# Altium project 3562.PrjPcb (part 4 of 5)

## Sheet P10_ETH0 RGMII.SchDoc
size 420 x 297 mm
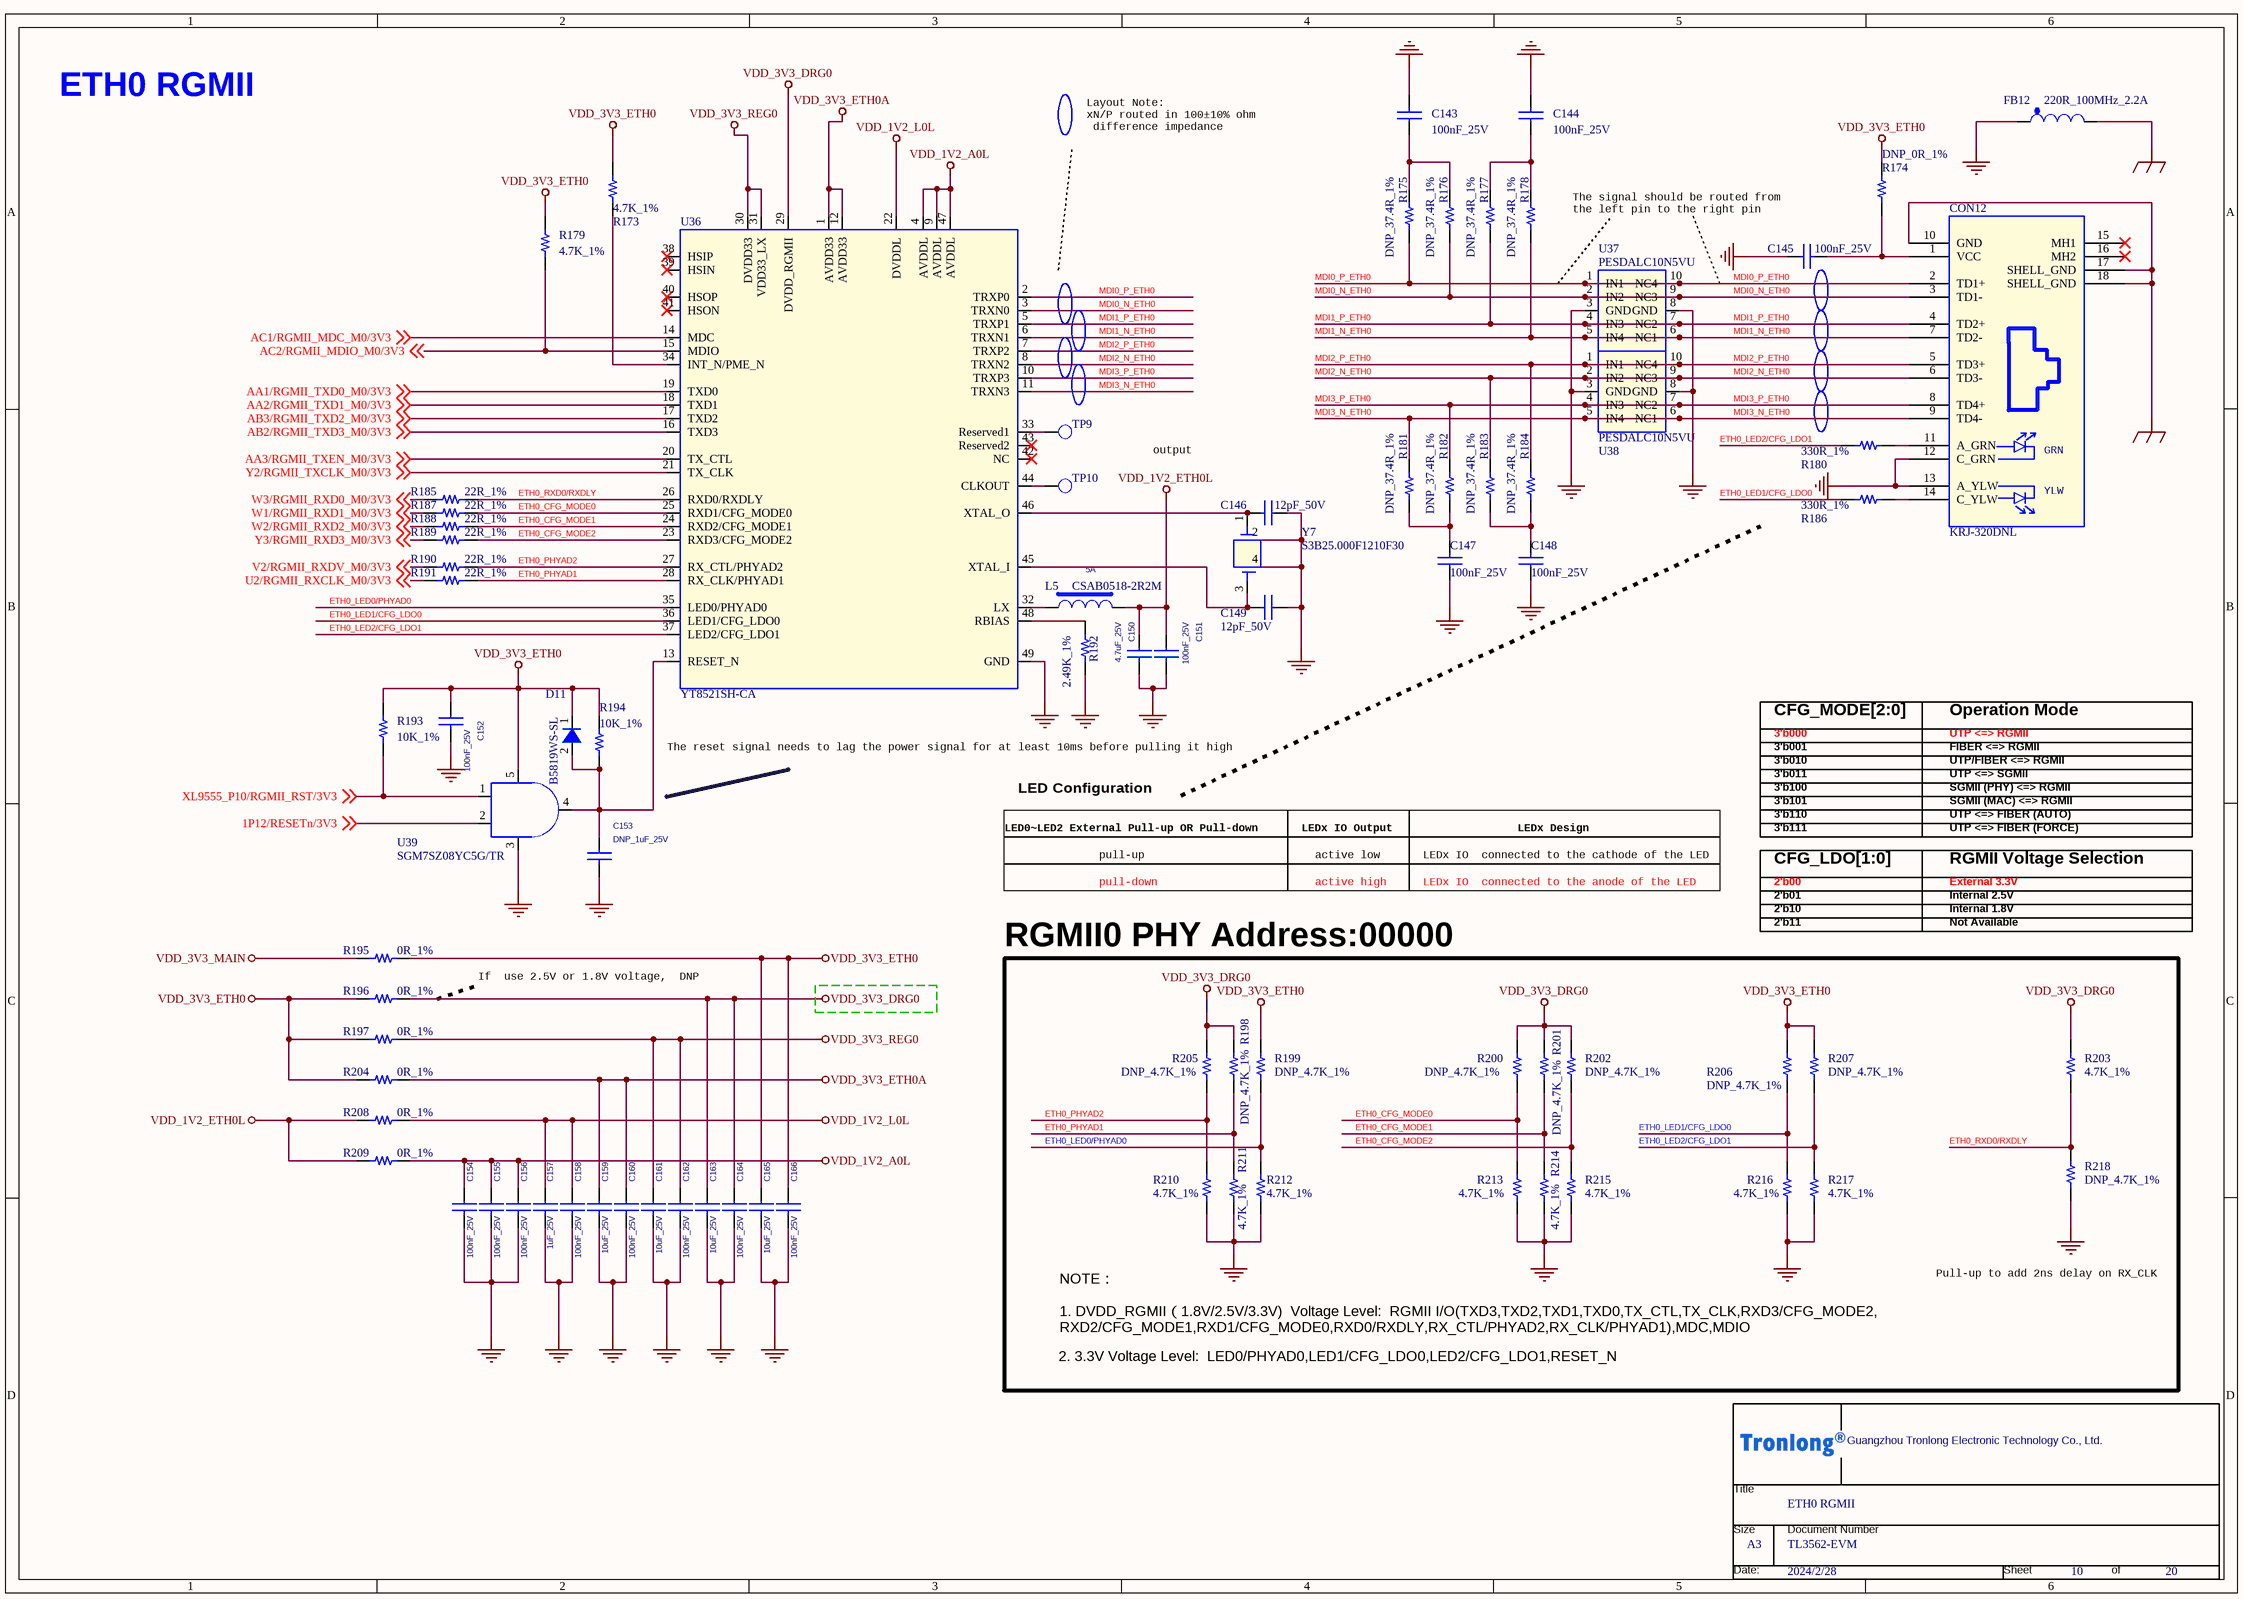
[diagram p23: P10_ETH0 RGMII.SchDoc]

### Parts
(Parts that share a designator on the sheet are numbered #1, #2 ... from top to bottom, then left to right.)
*#10  Page Count: 20  Page Number: 10  Page Size: A3  OrgName: Guangzhou Tronlong Electronic Technology Co., Ltd.  Title: ETH0 RGMII  Doc: TL3562-EVM  Page Modify Date: 2024/2/28  (hidden comment: Tronlong_TITTLE_20211115)  (graphical)
C143  100nF_25V  [C0402]
C144  100nF_25V  [C0402]
C145  100nF_25V  [C0402]
C146  12pF_50V  [C0402]
C147  100nF_25V  [C0402]
C148  100nF_25V  [C0402]
C149  12pF_50V  [C0402]
C150  4.7uF_25V  [C0603]
C151  100nF_25V  [C0402]
C152  100nF_25V  [C0402]
C153  DNP_1uF_25V  [C0603]
C154  100nF_25V  [C0402]
C155  100nF_25V  [C0402]
C156  100nF_25V  [C0402]
C157  1uF_25V  [C0603]
C158  100nF_25V  [C0402]
C159  10uF_25V  [C0603]
C160  100nF_25V  [C0402]
C161  10uF_25V  [C0603]
C162  100nF_25V  [C0402]
C163  10uF_25V  [C0603]
C164  100nF_25V  [C0402]
C165  10uF_25V  [C0603]
C166  100nF_25V  [C0402]
CON12  KRJ-320DNL  [KRJ-320DNL_14P]
D11  B5819WS-SL  [SOD-323]
FB12  220R_100MHz_2.2A  [L0603]
L5  CSAB0518-2R2M  Current: 5A  [SMD-L2520M-2P]
R173  4.7K_1%  [R0402]
R174  DNP_0R_1%  [R0402]
R175  DNP_37.4R_1%  [R0603]
R176  DNP_37.4R_1%  [R0603]
R177  DNP_37.4R_1%  [R0603]
R178  DNP_37.4R_1%  [R0603]
R179  4.7K_1%  [R0402]
R180  330R_1%  [R0402]
R181  DNP_37.4R_1%  [R0603]
R182  DNP_37.4R_1%  [R0603]
R183  DNP_37.4R_1%  [R0603]
R184  DNP_37.4R_1%  [R0603]
R185  22R_1%  [R0402]
R186  330R_1%  [R0402]
R187  22R_1%  [R0402]
R188  22R_1%  [R0402]
R189  22R_1%  [R0402]
R190  22R_1%  [R0402]
R191  22R_1%  [R0402]
R192  2.49K_1%  [R0603]
R193  10K_1%  [R0402]
R194  10K_1%  [R0402]
R195  0R_1%  [R0603]
R196  0R_1%  [R0603]
R197  0R_1%  [R0603]
R198  DNP_4.7K_1%  [R0402]
R199  DNP_4.7K_1%  [R0402]
R200  DNP_4.7K_1%  [R0402]
R201  DNP_4.7K_1%  [R0402]
R202  DNP_4.7K_1%  [R0402]
R203  4.7K_1%  [R0402]
R204  0R_1%  [R0603]
R205  DNP_4.7K_1%  [R0402]
R206  DNP_4.7K_1%  [R0402]
R207  DNP_4.7K_1%  [R0402]
R208  0R_1%  [R0603]
R209  0R_1%  [R0603]
R210  4.7K_1%  [R0402]
R211  4.7K_1%  [R0402]
R212  4.7K_1%  [R0402]
R213  4.7K_1%  [R0402]
R214  4.7K_1%  [R0402]
R215  4.7K_1%  [R0402]
R216  4.7K_1%  [R0402]
R217  4.7K_1%  [R0402]
R218  DNP_4.7K_1%  [R0402]
TP9  SMT TP  [TP30]  (value not drawn)
TP10  SMT TP  [TP30]  (value not drawn)
U36  YT8521SH-CA  [QFN48]
U37  PESDALC10N5VU  [DFN-10-2510]
U38  PESDALC10N5VU  [DFN-10-2510]
U39  SGM7SZ08YC5G/TR  [SC70-5-43M]
Y7  S3B25.000F1210F30  [SMD_3225]

### Blocks framed on the sheet
RGMII0 PHY Address:00000: R198-R203 R205-R207 R210-R218

### Nets
EGND: CON12.10(GND) CON12.17(SHELL_GND) CON12.18(SHELL_GND) FB12.2
GND: C143.2 C144.2 C145.1 C146.1 C147.1 C148.1 C149.1 C150.2 C151.2 C152.2 C153.2 C154.2 C155.2 C156.2 C157.2 C158.2 C159.2 C160.2 C161.2 C162.2 C163.2 C164.2 C165.2 C166.2 CON12.12(C_GRN) CON12.13(A_YLW) FB12.1 R192.1 R210.1 R211.1 R212.1 R213.1 R214.1 R215.1 R216.1 R217.1 R218.1 U36.49(GND) U37.3(GND) U37.8(GND) U38.3(GND) U38.8(GND) U39.3(GND) Y7.2 Y7.4
VDD_1V2_A0L: C154.1 C155.1 C156.1 R209.2 U36.4(AVDDL) U36.9(AVDDL) U36.47(AVDDL)
VDD_1V2_ETH0L: C150.1 C151.1 L5.2 R208.1 R209.1
VDD_1V2_L0L: C157.1 C158.1 R208.2 U36.22(DVDDL)
VDD_3V3_DRG0: C163.1 C164.1 R196.2 R198.2 R200.2 R201.2 R202.2 R203.2 R205.2 U36.29(DVDD_RGMII)
VDD_3V3_ETH0: C152.1 C165.1 C166.1 D11.1(Cathode) R173.2 R174.1 R179.1 R193.1 R194.2 R195.2 R196.1 R197.1 R199.2 R204.1 R206.2 R207.2 U39.5(VCC)
VDD_3V3_ETH0A: C159.1 C160.1 R204.2 U36.1(AVDD33) U36.12(AVDD33)
VDD_3V3_MAIN: R195.1
VDD_3V3_REG0: C161.1 C162.1 R197.2 U36.30(DVDD33) U36.31(VDD33_LX)
1P12/RESETn/3V3: U39.2(B) ; off-sheet 1P12/RESETn/3V3
AA1/RGMII_TXD0_M0/3V3: U36.19(TXD0) ; off-sheet AA1/RGMII_TXD0_M0/3V3
AA2/RGMII_TXD1_M0/3V3: U36.18(TXD1) ; off-sheet AA2/RGMII_TXD1_M0/3V3
AA3/RGMII_TXEN_M0/3V3: U36.20(TX_CTL) ; off-sheet AA3/RGMII_TXEN_M0/3V3
AB2/RGMII_TXD3_M0/3V3: U36.16(TXD3) ; off-sheet AB2/RGMII_TXD3_M0/3V3
AB3/RGMII_TXD2_M0/3V3: U36.17(TXD2) ; off-sheet AB3/RGMII_TXD2_M0/3V3
AC1/RGMII_MDC_M0/3V3: U36.14(MDC) ; off-sheet AC1/RGMII_MDC_M0/3V3
AC2/RGMII_MDIO_M0/3V3: R179.2 U36.15(MDIO) ; off-sheet AC2/RGMII_MDIO_M0/3V3
ETH0_CFG_MODE0: R187.2 R200.1 R213.2 U36.25(RXD1/CFG_MODE0)
ETH0_CFG_MODE1: R188.2 R201.1 R214.2 U36.24(RXD2/CFG_MODE1)
ETH0_CFG_MODE2: R189.2 R202.1 R215.2 U36.23(RXD3/CFG_MODE2)
ETH0_LED0/PHYAD0: R199.1 R212.2 U36.35(LED0/PHYAD0)
ETH0_LED1/CFG_LDO0: R186.1 R206.1 R216.2 U36.36(LED1/CFG_LDO0)
ETH0_LED2/CFG_LDO1: R180.1 R207.1 R217.2 U36.37(LED2/CFG_LDO1)
ETH0_PHYAD1: R191.2 R198.1 R211.2 U36.28(RX_CLK/PHYAD1)
ETH0_PHYAD2: R190.2 R205.1 R210.2 U36.27(RX_CTL/PHYAD2)
ETH0_RXD0/RXDLY: R185.2 R203.1 R218.2 U36.26(RXD0/RXDLY)
MDI0_N_ETH0: CON12.3(TD1-) R176.2 U36.3(TRXN0) U37.2(IN2) U37.9(NC3)
MDI0_P_ETH0: CON12.2(TD1+) R175.2 U36.2(TRXP0) U37.1(IN1) U37.10(NC4)
MDI1_N_ETH0: CON12.7(TD2-) R178.2 U36.6(TRXN1) U37.5(IN4) U37.6(NC1)
MDI1_P_ETH0: CON12.4(TD2+) R177.2 U36.5(TRXP1) U37.4(IN3) U37.7(NC2)
MDI2_N_ETH0: CON12.6(TD3-) R183.1 U36.8(TRXN2) U38.2(IN2) U38.9(NC3)
MDI2_P_ETH0: CON12.5(TD3+) R184.1 U36.7(TRXP2) U38.1(IN1) U38.10(NC4)
MDI3_N_ETH0: CON12.9(TD4-) R181.1 U36.11(TRXN3) U38.5(IN4) U38.6(NC1)
MDI3_P_ETH0: CON12.8(TD4+) R182.1 U36.10(TRXP3) U38.4(IN3) U38.7(NC2)
U2/RGMII_RXCLK_M0/3V3: R191.1 ; off-sheet U2/RGMII_RXCLK_M0/3V3
V2/RGMII_RXDV_M0/3V3: R190.1 ; off-sheet V2/RGMII_RXDV_M0/3V3
W1/RGMII_RXD1_M0/3V3: R187.1 ; off-sheet W1/RGMII_RXD1_M0/3V3
W2/RGMII_RXD2_M0/3V3: R188.1 ; off-sheet W2/RGMII_RXD2_M0/3V3
W3/RGMII_RXD0_M0/3V3: R185.1 ; off-sheet W3/RGMII_RXD0_M0/3V3
XL9555_P10/RGMII_RST/3V3: R193.2 U39.1(A) ; off-sheet XL9555_P10/RGMII_RST/3V3
Y2/RGMII_TXCLK_M0/3V3: U36.21(TX_CLK) ; off-sheet Y2/RGMII_TXCLK_M0/3V3
Y3/RGMII_RXD3_M0/3V3: R189.1 ; off-sheet Y3/RGMII_RXD3_M0/3V3
NetC143_1: C143.1 R175.1 R176.1
NetC144_1: C144.1 R177.1 R178.1
NetC145_2: C145.2 CON12.1(VCC) R174.2
NetC146_2: C146.2 U36.46(XTAL_O) Y7.1
NetC147_2: C147.2 R181.2 R182.2
NetC148_2: C148.2 R183.2 R184.2
NetC149_2: C149.2 U36.45(XTAL_I) Y7.3
NetC153_1: C153.1 D11.2(Anode) R194.1 U36.13(RESET_N) U39.4(Y)
NetCON12_11: CON12.11(A_GRN) R180.2
NetCON12_14: CON12.14(C_YLW) R186.2
NetL5_1: L5.1 U36.32(LX)
NetR173_1: R173.1 U36.34(INT_N/PME_N)
NetR192_2: R192.2 U36.48(RBIAS)
NetTP9_1: TP9.1(TP) U36.33(Reserved1)
NetTP10_1: TP10.1(TP) U36.44(CLKOUT)

Not connected (* = marked no-connect by the designer): CON12 15(MH1)* 16(MH2)*; U36 38(HSIP)* 39(HSIN)* 40(HSOP)* 41(HSON)* 42(NC)* 43(Reserved2)*

### Notes on the sheet
- ETH0 RGMII
- Layout Note:
  xN/P routed in 100±10% ohm
  difference impedance
- The signal should be routed from
  the left pin to the right pin
- output
- CFG_MODE[2:0]
- 3'b000
- UTP <=> RGMII
- Operation Mode
- The reset signal needs to lag the power signal for at least 10ms before pulling it high
- LED Configuration
- 3'b001
- 3'b010
- 3'b011
- 3'b100
- 3'b101
- FIBER <=> RGMII
- UTP/FIBER <=> RGMII
- UTP <=> SGMII
- SGMII (PHY) <=> RGMII
- SGMII (MAC) <=> RGMII
- LED0~LED2 External Pull-up OR Pull-down
- pull-up
- LEDx IO Output
- active low
- LEDx IO  connected to the cathode of the LED
- LEDx Design
- 3'b110
- 3'b111
- CFG_LDO[1:0]
- UTP <=> FIBER (AUTO)
- UTP <=> FIBER (FORCE)
- RGMII Voltage Selection
- pull-down
- active high
- LEDx IO  connected to the anode of the LED
- 2'b00
- 2'b01
- 2'b10
- 2'b11
- External 3.3V
- Internal 2.5V
- Internal 1.8V
- Not Available
- If  use 2.5V or 1.8V voltage,  DNP
- Pull-up to add 2ns delay on RX_CLK
- NOTE：
  1. DVDD_RGMII（1.8V/2.5V/3.3V)  Voltage Level:  RGMII I/O(TXD3,TXD2,TXD1,TXD0,TX_CTL,TX_CLK,RXD3/CFG_MODE2,
  RXD2/CFG_MODE1,RXD1/CFG_MODE0,RXD0/RXDLY,RX_CTL/PHYAD2,RX_CLK/PHYAD1),MDC,MDIO
- 2. 3.3V Voltage Level:  LED0/PHYAD0,LED1/CFG_LDO0,LED2/CFG_LDO1,RESET_N
- (in symbol KRJ-320DNL_1) GRN; YLW
- (in symbol Tronlong_TITTLE_20211115) Title; Size; Document Number; Date:; Sheet; of

### Library data of the parts
*#10 = Tronlong_TITTLE_20211115: RevCode: A?; Page Create Date: March  8, 1995
C143-C145 C147 C148 C151 C152 C154-C156 C158 C160 C162 C164 C166 = CAP NP_Dup3: 贴片陶瓷电容,100nF,10%,25V,X5R; Manufacturer Character: 中国大陆; Operation Temperature（℃）: -55~85℃; As-Welded: /; PCB Footprint: C0402
C146 C149 = CAP NP_Dup3: 贴片陶瓷电容,12pF,5%,50V,COG; Manufacturer Character: 中国大陆; As-Welded: /; Operation Temperature（℃）: -55~125℃; PCB Footprint: C0402
C150 = CAP NP_Dup3: 贴片陶瓷电容,4.7uF,10%,25V,X5R; Manufacturer Character: 中国大陆; Operation Temperature（℃）: -55~85℃; As-Welded: /; PCB Footprint: C0603
C153 = CAP NP_Dup3: 贴片陶瓷电容,1uF,10%,25V,X5R; Manufacturer Character: 中国大陆; As-Welded: DNP; Operation Temperature（℃）: -55~85℃; PCB Footprint: C0603
C157 = CAP NP_Dup3: 贴片陶瓷电容,1uF,10%,25V,X5R; Manufacturer Character: 中国大陆; Operation Temperature（℃）: -55~85℃; As-Welded: /; PCB Footprint: C0603
C159 C161 C165 = CAP NP_Dup3: 贴片陶瓷电容,10uF,10%,10V,X5R; Manufacturer Character: 中国大陆; As-Welded: /; Operation Temperature（℃）: -55~85℃; PCB Footprint: C0603
C163 = CAP NP_Dup3: 贴片陶瓷电容,10uF,10%,10V,X5R; Manufacturer Character: 中国大陆; Operation Temperature（℃）: -55~85℃; As-Welded: /; PCB Footprint: C0603
CON12 = KRJ-320DNL_1: RJ45连接器,14PIN,90度,母座,插件; Manufacturer: 东莞市科优达电子科技有限公司（DGKYD）; Manufacturer Character: 中国大陆; As-Welded: /; Operation Temperature（℃）: -40~85℃; Manufacturer PartNumber: KRJ-320DNL; Temperature: -40~85℃; PCB Footprint: KRJ-320DNL_14P
D11 = Diode200mA250V: 肖特基二极管,VR=40V,IF=1A,VF=0.6V@1A; Mfr: On Semiconductor; MfrNum: MMSD103T1G; TIIntPartnumber: 1E0013; Manufacturer Character: 中国大陆; Manufacturer: 江苏长晶科技有限公司（JSCJ）; Descriptive_Text: Diode 200mA 250V 1.25V Forward Drop; Vendor: Digikey; Cost100: 0.23; Cost10K: 0.07; PCB Footprint: smd123; As-Welded: /; Operation Temperature（℃）: -55~125℃; PartName: Diode200mA250V; DescriptiveText: Diode 200mA 250V 1.25V Forward Drop; Temperature: -55~150; Manufacturer PartNumber: B5819WS-SL
FB12 = FERRITE BEAD_Dup2: 磁珠,50mΩ,2.2A,220R@100MHz; Manufacturer Character: 中国大陆; Manufacturer: 深圳顺络电子股份有限公司（Sunlord）; Manufacturer PartNumber: UPZ1608U221-2R2TF; As-Welded: /; Operation Temperature（℃）: -55~125℃; Temperature: -55~125; PCB Footprint: L0603
L5 = INDUCTOR: 贴片功率电感,2.2uH,0.035Ω,Isat=6.5A,Irms=5A; Manufacturer Character: 中国大陆; Manufacturer: 深圳市科达嘉电子有限公司（CODACA）; Parameter: L2520，奇力新一体成型电感，最大额定电流3A，内阻65毫欧，20%; PCB Footprint: SMD_CSAB0518; As-Welded: /; Operation Temperature（℃）: -40~125℃; Manufacturer PartNumber: CSAB0518-2R2M; Temperature: -40~125℃
R173 R179 R212 R214-R217 = Resistor_Dup3: 贴片电阻,4.7K,±1%,1/16W; Manufacturer Character: 中国大陆; CLASS: DISCRETE; As-Welded: /; Operation Temperature（℃）: -55~155℃; PCB Footprint: R0402
R174 = Resistor_Dup3: 贴片电阻,0R,±1%,1/16W; Manufacturer Character: 中国大陆; CLASS: DISCRETE; Operation Temperature（℃）: -55~155℃; As-Welded: DNP; PCB Footprint: R0402
R175-R178 R181-R184 = Resistor_Dup3: 37.4R,±1%,R0603,≥1/10W; Manufacturer Character: 中国大陆; CLASS: DISCRETE; Operation Temperature（℃）: -40~85℃; As-Welded: DNP; PCB Footprint: R0603
R180 R186 = Resistor_Dup3: 贴片电阻,330R,±1%,1/16W; Manufacturer Character: 中国大陆; CLASS: DISCRETE; Operation Temperature（℃）: -55~155℃; As-Welded: /; PCB Footprint: R0402
R185 R187-R191 = Resistor_Dup3: 贴片电阻,22R,±1%,1/16W; Manufacturer Character: 中国大陆; CLASS: DISCRETE; As-Welded: /; Operation Temperature（℃）: -55~155℃; room: RS232; PCB Footprint: R0402
R192 = Resistor_Dup3: 贴片电阻,2.49K,±1%,1/10W; Manufacturer Character: 中国大陆; CLASS: DISCRETE; Operation Temperature（℃）: -55~155℃; As-Welded: /; PCB Footprint: R0603
R193 R194 = Resistor_Dup3: 贴片电阻,10K,±1%,1/16W; Manufacturer Character: 中国大陆; CLASS: DISCRETE; As-Welded: /; Operation Temperature（℃）: -55~155℃; PCB Footprint: R0402
  R193: Temperature: –55~155℃
R195-R197 R204 R208 R209 = Resistor_Dup3: 0R,±1%,R0603,≥1/10W; Manufacturer Character: 中国大陆; CLASS: DISCRETE; Operation Temperature（℃）: -55~155℃; room: RS232; As-Welded: /; PCB Footprint: R0603
R198 R199 R201 R202 R205-R207 R218 = Resistor_Dup3: 贴片电阻,4.7K,±1%,1/16W; Manufacturer Character: 中国大陆; CLASS: DISCRETE; Operation Temperature（℃）: -55~155℃; As-Welded: DNP; PCB Footprint: R0402
R200 = Resistor_Dup3: 贴片电阻,4.7K,±1%,1/16W; Manufacturer Character: 中国大陆; CLASS: DISCRETE; As-Welded: DNP; Operation Temperature（℃）: -55~155℃; PCB Footprint: R0402
R203 R210 R211 R213 = Resistor_Dup3: 贴片电阻,4.7K,±1%,1/16W; Manufacturer Character: 中国大陆; CLASS: DISCRETE; Operation Temperature（℃）: -55~155℃; As-Welded: /; PCB Footprint: R0402
TP9 TP10 = T POINT R: Manufacturer Character: 中国大陆; CLASS: IC; AGILE_PN: 510-75618; CAD_APPROVED: Yes; As-Welded: /; PCB Footprint: TP30; HEIGHT: 0.1MM
U36 = YT8521S: 以太网收发器，RGMII/SGMII; Manufacturer: 苏州裕太微电子有限公司（Motorcomm）; Manufacturer Character: 中国大陆; As-Welded: /; Operation Temperature（℃）: -40~85℃; Manufacturer PartNumber: YT8521SH-CA; Temperature: -40~85; PCB Footprint: QFN48
U37 = SU099PGTR: 4通道超低电容瞬态抑制器; Manufacturer Character: 中国大陆; Manufacturer: 上海芯导电子科技有限公司（Prisemi）; Operation Temperature（℃）: -40~85℃; As-Welded: /; Manufacturer PartNumber: PESDALC10N5VU; Temperature: -55~150; PCB Footprint: DFN-10-2510
U38 = SU099PGTR: 4通道超低电容瞬态抑制器; Manufacturer: 上海芯导电子科技有限公司（Prisemi）; Manufacturer Character: 中国大陆; Operation Temperature（℃）: -40~85℃; As-Welded: /; Manufacturer PartNumber: PESDALC10N5VU; Temperature: -55~150; PCB Footprint: DFN-10-2510
U39 = 74LVC1G08: 1个两输入与门; Manufacturer: 圣邦微电子股份有限公司（SGMICRO）; Manufacturer Character: 中国大陆; As-Welded: /; Operation Temperature（℃）: -40~85℃; Manufacturer PartNumber: SGM7SZ08YC5G/TR; Temperature: -40~85℃; PCB Footprint: SC70-5-43M
Y7 = CRYSTAL-4 PIN: 四脚无源晶振,25MHz,±10ppm,12pF,30Ω,±30ppm; Manufacturer Character: 中国大陆; Manufacturer: 深圳市星通时频电子有限公司公司（JSCJ）; As-Welded: /; Operation Temperature（℃）: -40~85℃; Manufacturer PartNumber: S3B25.000F1210F30; Temperature: -40~85; PCB Footprint: SMD_3225

## Sheet P11_ETH1 RMII.SchDoc
size 420 x 297 mm
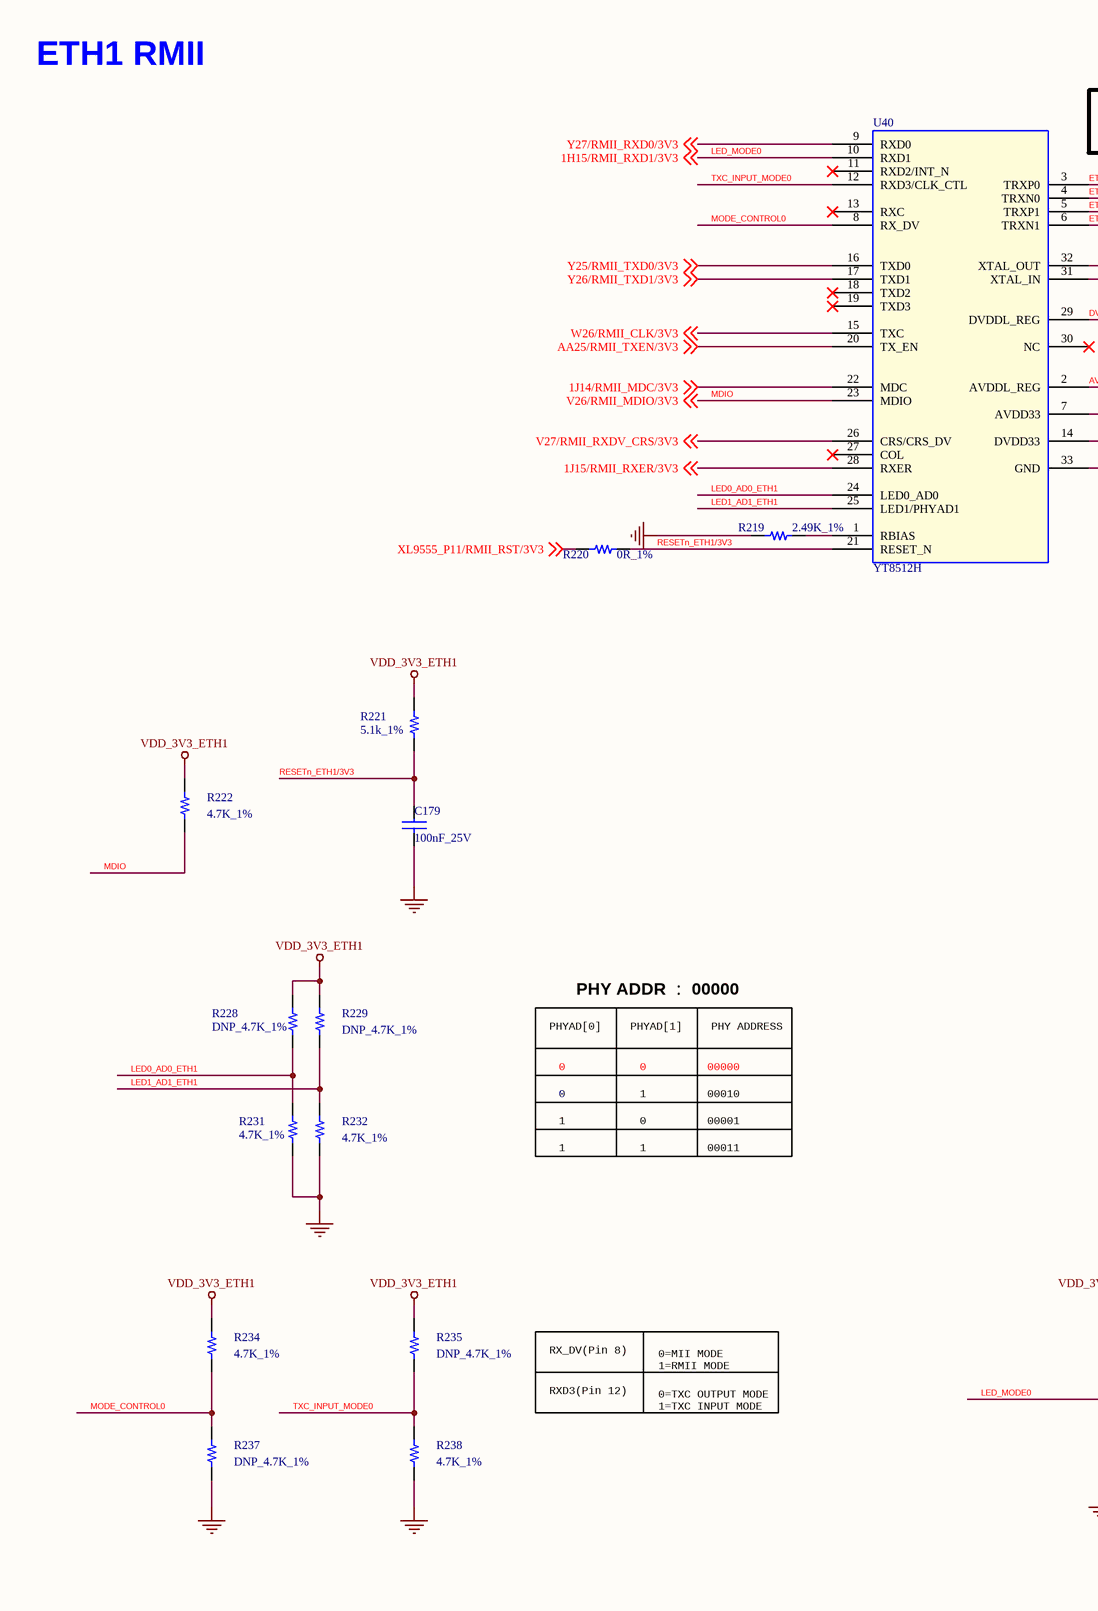
[diagram p24: P11_ETH1 RMII.SchDoc, left]
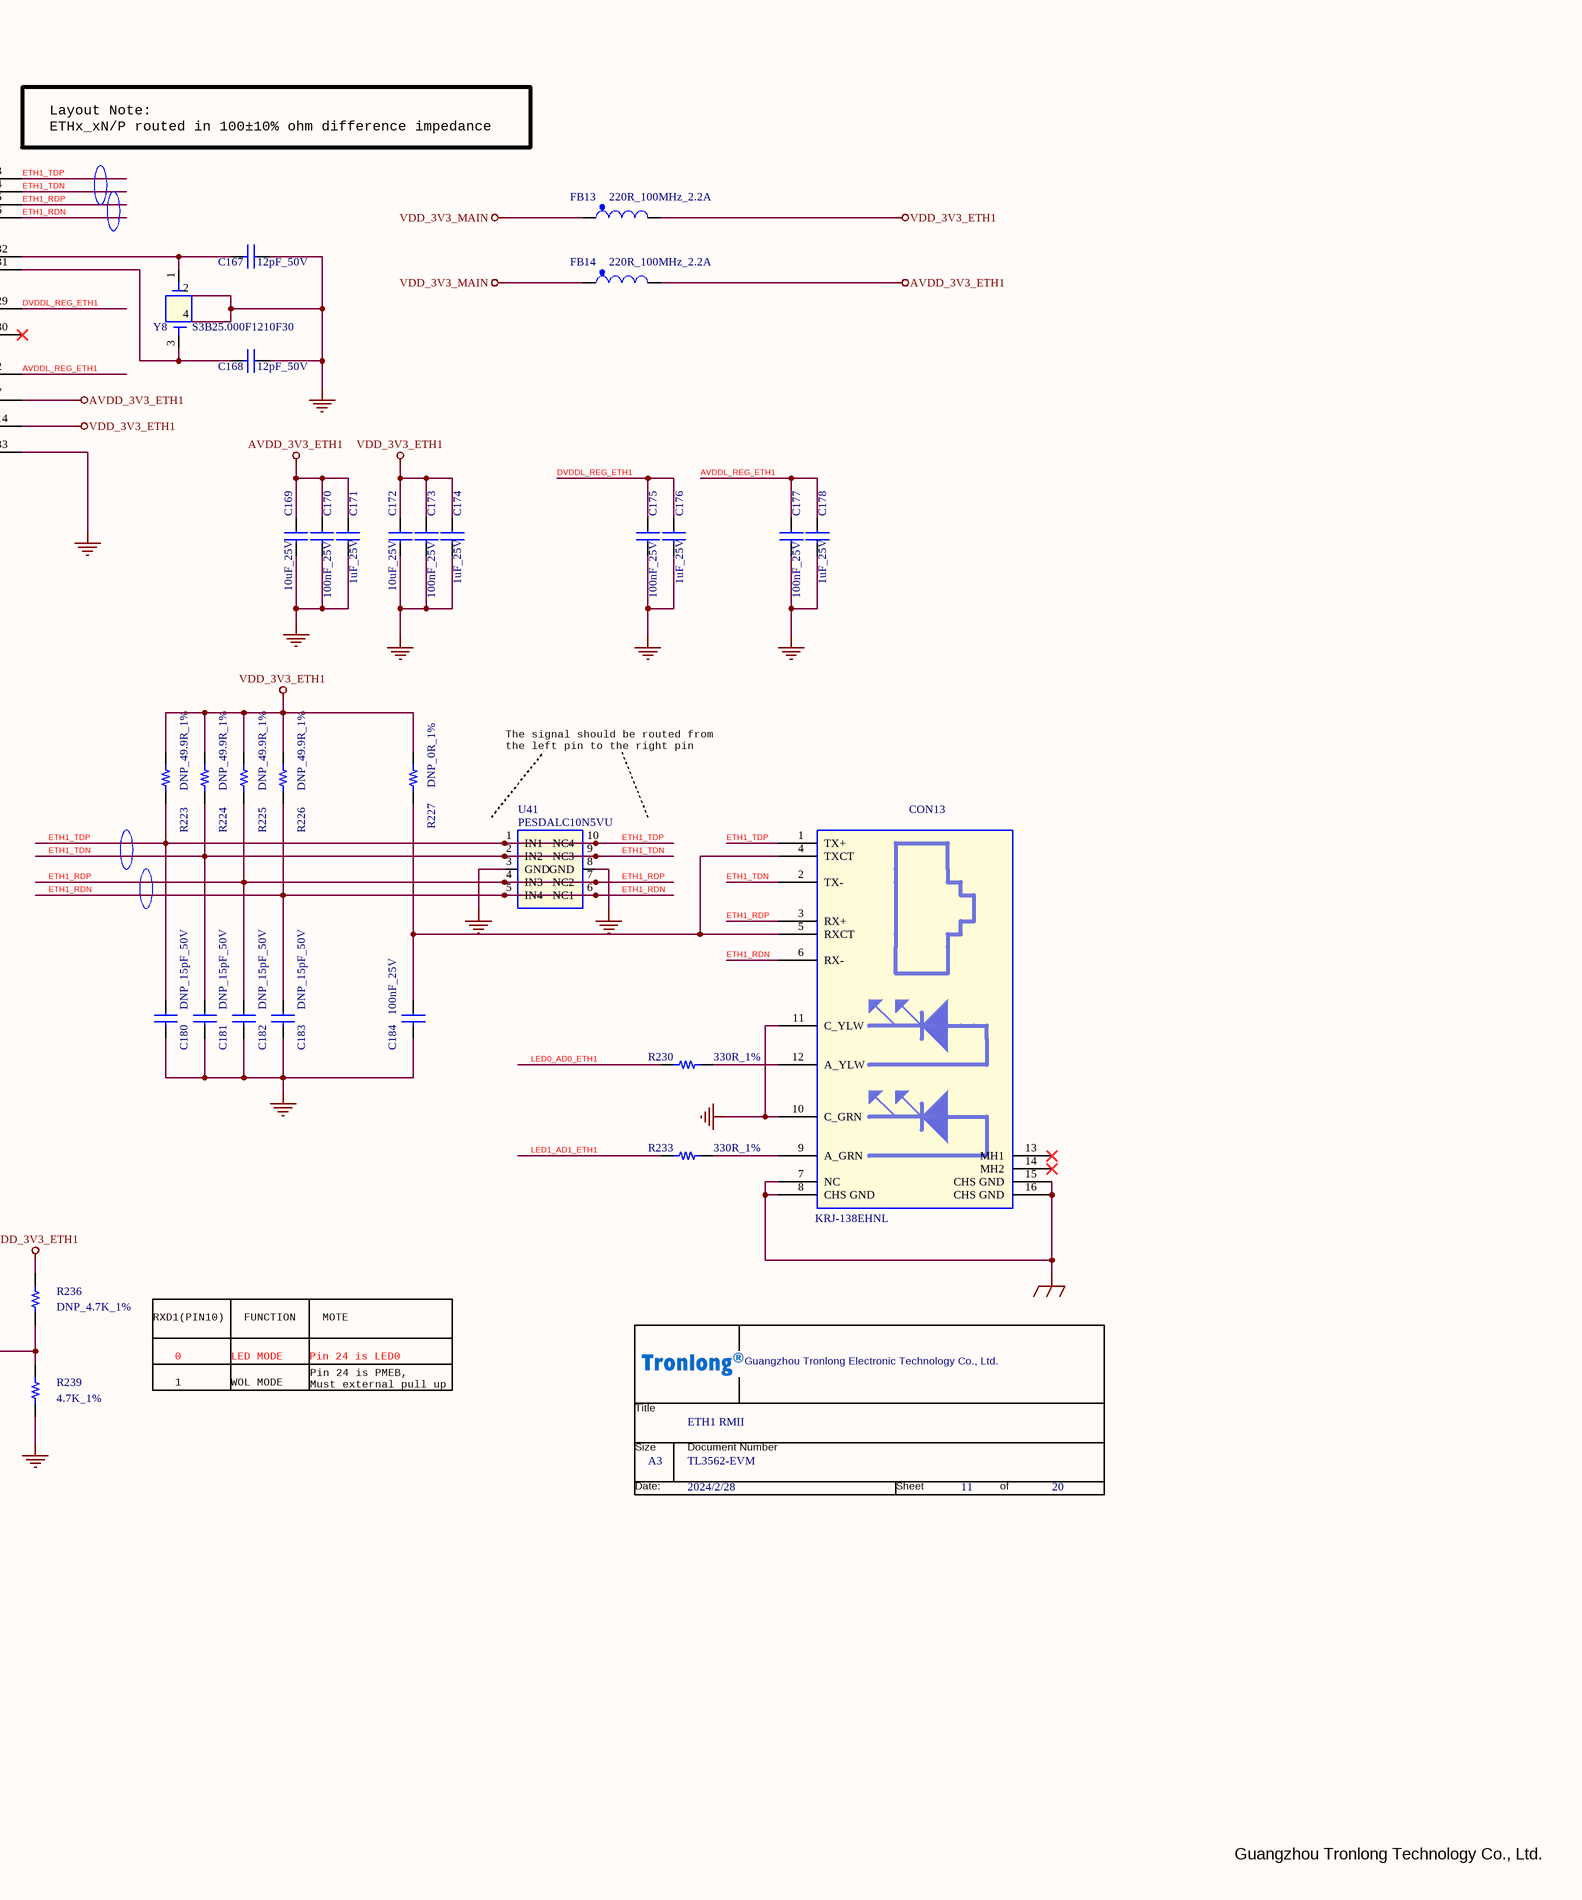
[diagram p25: P11_ETH1 RMII.SchDoc, right]

### Parts
(Parts that share a designator on the sheet are numbered #1, #2 ... from top to bottom, then left to right.)
*#11  Page Count: 20  Page Number: 11  Page Size: A3  OrgName: Guangzhou Tronlong Electronic Technology Co., Ltd.  Title: ETH1 RMII  Doc: TL3562-EVM  Page Modify Date: 2024/2/28  (hidden comment: Tronlong_TITTLE_20211115)  (graphical)
C167  12pF_50V  [C0402]
C168  12pF_50V  [C0402]
C169  10uF_25V  [C0603]
C170  100nF_25V  [C0402]
C171  1uF_25V  [C0603]
C172  10uF_25V  [C0603]
C173  100nF_25V  [C0402]
C174  1uF_25V  [C0603]
C175  100nF_25V  [C0402]
C176  1uF_25V  [C0603]
C177  100nF_25V  [C0402]
C178  1uF_25V  [C0603]
C179  100nF_25V  [C0402]
C180  DNP_15pF_50V  [C0603]
C181  DNP_15pF_50V  [C0603]
C182  DNP_15pF_50V  [C0603]
C183  DNP_15pF_50V  [C0603]
C184  100nF_25V  [C0402]
CON13  KRJ-138EHNL  [CON_YDS_13F-64GYD2PLXNL]
FB13  220R_100MHz_2.2A  [L0603]
FB14  220R_100MHz_2.2A  [L0603]
R219  2.49K_1%  [R0603]
R220  0R_1%  [R0402]
R221  5.1k_1%  [R0402]
R222  4.7K_1%  [R0402]
R223  DNP_49.9R_1%  [R0603]
R224  DNP_49.9R_1%  [R0603]
R225  DNP_49.9R_1%  [R0603]
R226  DNP_49.9R_1%  [R0603]
R227  DNP_0R_1%  [R0402]
R228  DNP_4.7K_1%  [R0402]
R229  DNP_4.7K_1%  [R0402]
R230  330R_1%  [R0402]
R231  4.7K_1%  [R0402]
R232  4.7K_1%  [R0402]
R233  330R_1%  [R0402]
R234  4.7K_1%  [R0402]
R235  DNP_4.7K_1%  [R0402]
R236  DNP_4.7K_1%  [R0402]
R237  DNP_4.7K_1%  [R0402]
R238  4.7K_1%  [R0402]
R239  4.7K_1%  [R0402]
U40  YT8512H  [QFN32]
U41  PESDALC10N5VU  [DFN-10-2510]
Y8  S3B25.000F1210F30  [SMD_3225]

### Nets
AVDD_3V3_ETH1: C169.1 C170.1 C171.1 FB14.2 U40.7(AVDD33)
EGND: CON13.7(NC) CON13.8(CHS_GND) CON13.15(CHS_GND) CON13.16(CHS_GND)
GND: C167.1 C168.1 C169.2 C170.2 C171.2 C172.2 C173.2 C174.2 C175.2 C176.2 C177.2 C178.2 C179.2 C180.2 C181.2 C182.2 C183.2 C184.2 CON13.10(C_GRN) CON13.11(C_YLW) R219.2 R231.1 R232.1 R237.2 R238.2 R239.2 U40.33(GND) U41.3(GND) U41.8(GND) Y8.2 Y8.4
VDD_3V3_ETH1: C172.1 C173.1 C174.1 FB13.2 R221.1 R222.1 R223.1 R224.1 R225.1 R226.1 R227.2 R228.2 R229.2 R234.2 R235.2 R236.2 U40.14(DVDD33)
VDD_3V3_MAIN: FB13.1 FB14.1
1J14/RMII_MDC/3V3: U40.22(MDC) ; off-sheet 1J14/RMII_MDC/3V3
1J15/RMII_RXER/3V3: U40.28(RXER) ; off-sheet 1J15/RMII_RXER/3V3
AA25/RMII_TXEN/3V3: U40.20(TX_EN) ; off-sheet AA25/RMII_TXEN/3V3
AVDDL_REG_ETH1: C177.1 C178.1 U40.2(AVDDL_REG)
DVDDL_REG_ETH1: C175.1 C176.1 U40.29(DVDDL_REG)
ETH1_RDN: C183.1 CON13.6(RX-) R226.2 U40.6(TRXN1) U41.5(IN4) U41.6(NC1)
ETH1_RDP: C182.1 CON13.3(RX+) R225.2 U40.5(TRXP1) U41.4(IN3) U41.7(NC2)
ETH1_TDN: C181.1 CON13.2(TX-) R224.2 U40.4(TRXN0) U41.2(IN2) U41.9(NC3)
ETH1_TDP: C180.1 CON13.1(TX+) R223.2 U40.3(TRXP0) U41.1(IN1) U41.10(NC4)
LED0_AD0_ETH1: R228.1 R230.1 R231.2 U40.24(LED0_AD0)
LED1_AD1_ETH1: R229.1 R232.2 R233.1 U40.25(LED1/PHYAD1)
LED_MODE0: R236.1 R239.1 U40.10(RXD1) ; off-sheet 1H15/RMII_RXD1/3V3  [also labelled 1H15/RMII_RXD1/3V3]
MDIO: R222.2 U40.23(MDIO) ; off-sheet V26/RMII_MDIO/3V3  [also labelled V26/RMII_MDIO/3V3]
MODE_CONTROL0: R234.1 R237.1 U40.8(RX_DV)
RESETn_ETH1/3V3: C179.1 R220.2 R221.2 U40.21(RESET_N)
TXC_INPUT_MODE0: R235.1 R238.1 U40.12(RXD3/CLK_CTL)
V27/RMII_RXDV_CRS/3V3: U40.26(CRS/CRS_DV) ; off-sheet V27/RMII_RXDV_CRS/3V3
W26/RMII_CLK/3V3: U40.15(TXC) ; off-sheet W26/RMII_CLK/3V3
XL9555_P11/RMII_RST/3V3: R220.1 ; off-sheet XL9555_P11/RMII_RST/3V3
Y25/RMII_TXD0/3V3: U40.16(TXD0) ; off-sheet Y25/RMII_TXD0/3V3
Y26/RMII_TXD1/3V3: U40.17(TXD1) ; off-sheet Y26/RMII_TXD1/3V3
Y27/RMII_RXD0/3V3: U40.9(RXD0) ; off-sheet Y27/RMII_RXD0/3V3
NetC167_2: C167.2 U40.32(XTAL_OUT) Y8.1
NetC168_2: C168.2 U40.31(XTAL_IN) Y8.3
NetC184_1: C184.1 CON13.4(TXCT) CON13.5(RXCT) R227.1
NetCON13_9: CON13.9(A_GRN) R233.2
NetCON13_12: CON13.12(A_YLW) R230.2
NetR219_1: R219.1 U40.1(RBIAS)

Not connected (* = marked no-connect by the designer): CON13 13(MH1)* 14(MH2)*; U40 11(RXD2/INT_N)* 13(RXC)* 18(TXD2)* 19(TXD3)* 27(COL)* 30(NC)*

### Notes on the sheet
- ETH1 RMII
- Layout Note:
  ETHx_xN/P routed in 100±10% ohm difference impedance
- The signal should be routed from
  the left pin to the right pin
- PHYAD[0]
- PHY ADDR ： 00000
- PHYAD[1]
- PHY ADDRESS
- 0
- 1
- 00000
- 00010
- 00001
- 00011
- RX_DV(Pin 8)
- 0=MII MODE
  1=RMII MODE
- RXD1(PIN10)
- FUNCTION
- MOTE
- RXD3(Pin 12)
- 0=TXC OUTPUT MODE
  1=TXC INPUT MODE
- LED MODE
- WOL MODE
- Pin 24 is LED0
- Pin 24 is PMEB,
  Must external pull up
- Guangzhou Tronlong Technology Co., Ltd.
- (in symbol Tronlong_TITTLE_20211115) Title; Size; Document Number; Date:; Sheet; of

### Library data of the parts
*#11 = Tronlong_TITTLE_20211115: RevCode: A?; Page Create Date: March  8, 1995
C167 = CAP NP_2: 贴片陶瓷电容,12pF,5%,50V,COG; Manufacturer Character: 中国大陆; room: 10; Operation Temperature（℃）: -55~125℃; As-Welded: /; PCB Footprint: C0402
C168 = CAP NP_2: 贴片陶瓷电容,12pF,5%,50V,COG; Manufacturer Character: 中国大陆; As-Welded: /; Operation Temperature（℃）: -55~125℃; room: 10; PCB Footprint: C0402
C169 C172 = CAP NP_2: 贴片陶瓷电容,10uF,10%,10V,X5R; Manufacturer Character: 中国大陆; room: 10; Operation Temperature（℃）: -55~85℃; As-Welded: /; PCB Footprint: C0603
C170 C173 C175 C177 = CAP NP_2: 贴片陶瓷电容,100nF,10%,25V,X5R; Manufacturer Character: 中国大陆; As-Welded: /; room: 10; Operation Temperature（℃）: -55~85℃; PCB Footprint: C0402
C171 C176 C178 = CAP NP_2: 贴片陶瓷电容,1uF,10%,25V,X5R; Manufacturer Character: 中国大陆; As-Welded: /; room: 10; Operation Temperature（℃）: -55~85℃; PCB Footprint: C0603
C174 = CAP NP_2: 贴片陶瓷电容,1uF,10%,25V,X5R; Manufacturer Character: 中国大陆; As-Welded: /; Operation Temperature（℃）: -55~85℃; room: 10; PCB Footprint: C0603
C179 = CAP NP_2: 贴片陶瓷电容,100nF,10%,25V,X5R; Manufacturer Character: 中国大陆; As-Welded: /; Operation Temperature（℃）: -55~85℃; room: 10; PCB Footprint: C0402
C180 = CAP NP_3: 贴片陶瓷电容,15pF,5%,50V,COG; Manufacturer Character: 中国大陆; As-Welded: DNP; room: ecat1; Operation Temperature（℃）: -55~125℃; Temperature: -55~125℃; PCB Footprint: C0603
C181-C183 = CAP NP_3: 贴片陶瓷电容,15pF,5%,50V,COG; Manufacturer Character: 中国大陆; Operation Temperature（℃）: -55~125℃; room: ecat1; As-Welded: DNP; Temperature: -55~125℃; PCB Footprint: C0603
C184 = CAP NP_3: 贴片陶瓷电容,100nF,10%,25V,X5R; Manufacturer Character: 中国大陆; As-Welded: /; room: ecat1; Operation Temperature（℃）: -55~85℃; Temperature: -55~125℃; PCB Footprint: C0402
CON13 = ETHERNET CONNECTER: RJ45连接器,12PIN,90度,母座,插件; Manufacturer Character: 中国大陆; Manufacturer: 东莞市科优达电子科技有限公司（DGKYD）; As-Welded: /; room: ecat1; Operation Temperature（℃）: -40~85℃; Manufacturer PartNumber: KRJ-138EHNL; Manufacturer Part Number: KRJ-138EHNL; Temperature: -40~85℃; PCB Footprint: CON_YDS_13F-64GYD2PLXNL
FB13 = FERRITE BEAD_Dup2: 磁珠,50mΩ,2.2A,220R@100MHz; Manufacturer PartNumber: UPZ1608U221-2R2TF; Manufacturer: 深圳顺络电子股份有限公司（Sunlord）; Manufacturer Character: 中国大陆; As-Welded: /; Operation Temperature（℃）: -55~125℃; Temperature: -40~85℃; PCB Footprint: L0603
FB14 = FERRITE BEAD_Dup2: 磁珠,50mΩ,2.2A,220R@100MHz; Manufacturer: 深圳顺络电子股份有限公司（Sunlord）; Manufacturer PartNumber: UPZ1608U221-2R2TF; Manufacturer Character: 中国大陆; As-Welded: /; Operation Temperature（℃）: -55~125℃; Temperature: -40~85℃; PCB Footprint: L0603
R219 = R_1: 贴片电阻,2.49K,±1%,1/10W; Manufacturer Character: 中国大陆; As-Welded: /; room: USB HUB; Operation Temperature（℃）: -55~155℃; PCB Footprint: R0603
R220 = R_1: 0R,±1%,R0402,≥1/16W; Manufacturer Character: 中国大陆; As-Welded: /; Operation Temperature（℃）: -55~155℃; room: USB HUB; PCB Footprint: R0402
R221 = R 1%: 贴片电阻,5.1K,±1%,1/16W; Manufacturer Character: 中国大陆; Characteristic: 0402 1/16W +/-1%; CLASS: DISCRETE; As-Welded: /; room: JTAG; Operation Temperature（℃）: -55~155℃; Temperature: -55~125℃; PCB Footprint: R0402
R222 R231 R232 R239 = R_1: 贴片电阻,4.7K,±1%,1/16W; Manufacturer Character: 中国大陆; As-Welded: /; room: DRDUSB; Operation Temperature（℃）: -55~155℃; PCB Footprint: R0402
R223 = R_0: 贴片电阻,49.9R,±1%,1/10W; Manufacturer Character: 中国大陆; room: ecat1; As-Welded: DNP; Operation Temperature（℃）: -40~85℃; PCB Footprint: R0603; Temperature: -55~155℃
R224-R226 = R_0: 贴片电阻,49.9R,±1%,1/10W; Manufacturer Character: 中国大陆; Operation Temperature（℃）: -40~85℃; As-Welded: DNP; room: ecat1; Temperature: -55~155℃; PCB Footprint: R0603
R227 = R_0: 贴片电阻,0R,±1%,1/16W; Manufacturer Character: 中国大陆; Operation Temperature（℃）: -55~155℃; As-Welded: DNP; room: ecat1; Temperature: -55~155℃; PCB Footprint: R0402
R228 R229 R236 R237 = R_1: 贴片电阻,4.7K,±1%,1/16W; Manufacturer Character: 中国大陆; Operation Temperature（℃）: -55~155℃; As-Welded: DNP; room: DRDUSB; PCB Footprint: R0402
R230 R233 = R_0: 贴片电阻,330R,±1%,1/16W; Manufacturer Character: 中国大陆; As-Welded: /; room: ecat1; Operation Temperature（℃）: -55~155℃; Temperature: –55~155℃; PCB Footprint: R0402
R234 = R_1: 贴片电阻,4.7K,±1%,1/16W; Manufacturer Character: 中国大陆; Operation Temperature（℃）: -55~155℃; room: DRDUSB; As-Welded: /; PCB Footprint: R0402
R235 = R_1: 贴片电阻,4.7K,±1%,1/16W; Manufacturer Character: 中国大陆; Operation Temperature（℃）: -55~155℃; room: DRDUSB; As-Welded: DNP; PCB Footprint: R0402
R238 = R_1: 贴片电阻,4.7K,±1%,1/16W; Manufacturer Character: 中国大陆; room: DRDUSB; As-Welded: /; Operation Temperature（℃）: -55~155℃; PCB Footprint: R0402
U40 = YT8512H_1: 以太网收发器，MII/RMII; Manufacturer Character: 中国大陆; Manufacturer: 苏州裕太微电子有限公司（Motorcomm）; Operation Temperature（℃）: -40~85℃; As-Welded: /; Temperature: -40~85℃; Manufacturer PartNumber: YT8512H; PCB Footprint: QFN32
U41 = SU099PGTR: as U37 on sheet P10_ETH0 RGMII; Temperature: -55~150; Manufacturer PartNumber: PESDALC10N5VU; PCB Footprint: DFN-10-2510
Y8 = CRYSTAL-4 PIN: as Y7 on sheet P10_ETH0 RGMII; Manufacturer PartNumber: S3B25.000F1210F30; Temperature: -40~85℃; PCB Footprint: SMD_3225

## Sheet P12_ETH2 USB.SchDoc
size 297 x 209 mm
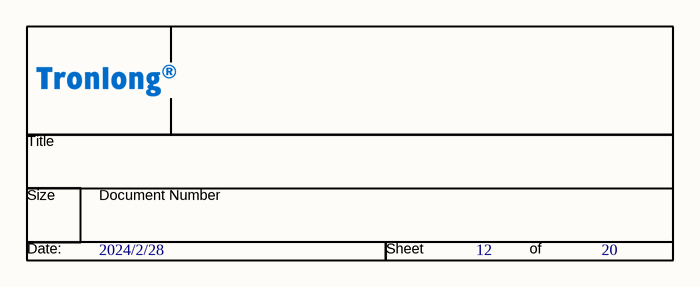
[diagram p26: P12_ETH2 USB.SchDoc]

### Parts
(Parts that share a designator on the sheet are numbered #1, #2 ... from top to bottom, then left to right.)
*#12  Page Count: 20  Page Number: 12  Page Modify Date: 2024/2/28  (hidden comment: Tronlong_TITTLE_20211115)  (graphical)

### Notes on the sheet
- (in symbol Tronlong_TITTLE_20211115) Title; Size; Document Number; Date:; Sheet; of

### Library data of the parts
*#12 = Tronlong_TITTLE_20211115: RevCode: A?; Page Create Date: March  8, 1995

## Sheet P13_ETH3_USB.SchDoc
size 297 x 209 mm
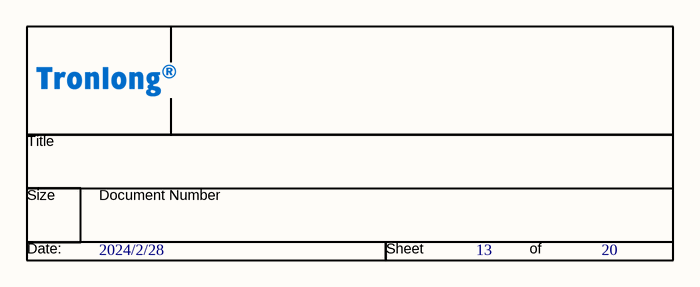
[diagram p27: P13_ETH3_USB.SchDoc]

### Parts
(Parts that share a designator on the sheet are numbered #1, #2 ... from top to bottom, then left to right.)
*#13  Page Count: 20  Page Number: 13  Page Modify Date: 2024/2/28  (hidden comment: Tronlong_TITTLE_20211115)  (graphical)

### Notes on the sheet
- (in symbol Tronlong_TITTLE_20211115) Title; Size; Document Number; Date:; Sheet; of

### Library data of the parts
*#13 = Tronlong_TITTLE_20211115: RevCode: A?; Page Create Date: March  8, 1995

## Sheet P14_WIFI_BLUETOOTH.SchDoc
size 297 x 209 mm
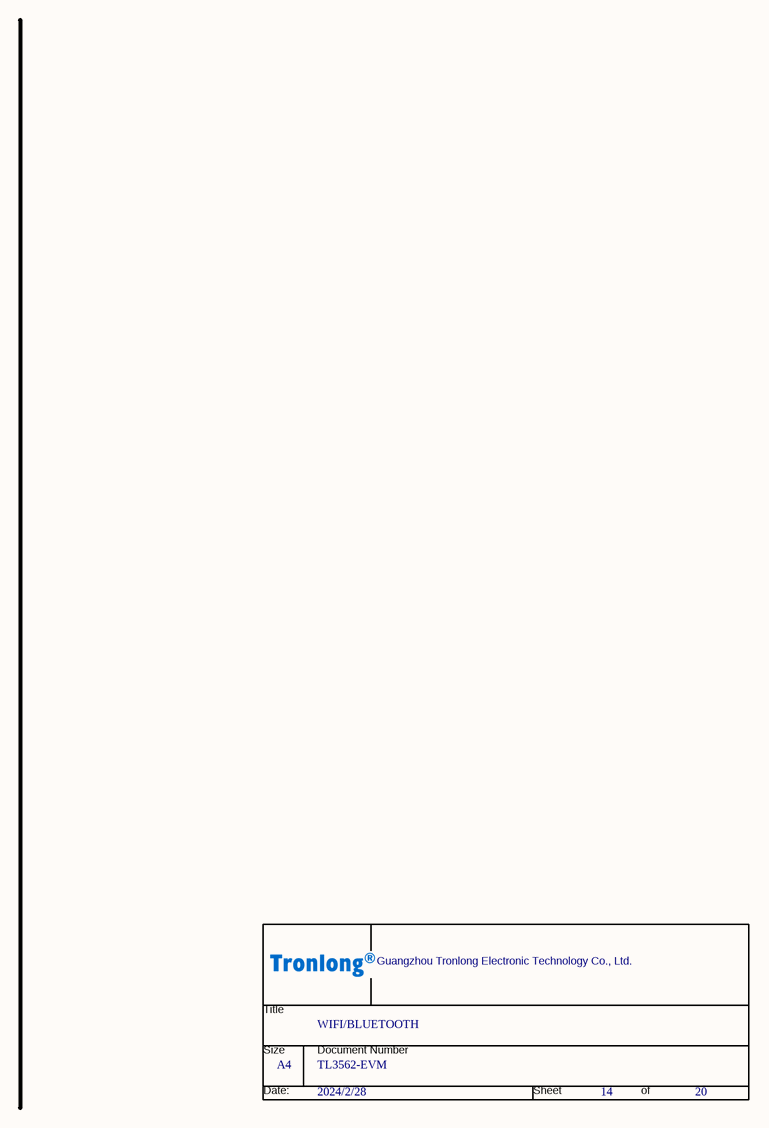
[diagram p28: P14_WIFI_BLUETOOTH.SchDoc]

### Parts
(Parts that share a designator on the sheet are numbered #1, #2 ... from top to bottom, then left to right.)
*#14  Page Count: 20  Page Number: 14  Page Size: A4  OrgName: Guangzhou Tronlong Electronic Technology Co., Ltd.  Title: WIFI/BLUETOOTH  Doc: TL3562-EVM  Page Modify Date: 2024/2/28  (hidden comment: Tronlong_TITTLE_20211115)  (graphical)

### Notes on the sheet
- (in symbol Tronlong_TITTLE_20211115) Title; Size; Document Number; Date:; Sheet; of

### Library data of the parts
*#14 = Tronlong_TITTLE_20211115: RevCode: A?; Page Create Date: March  8, 1995

## Sheet P15_4G_5G_NVME.SchDoc
size 594 x 420 mm
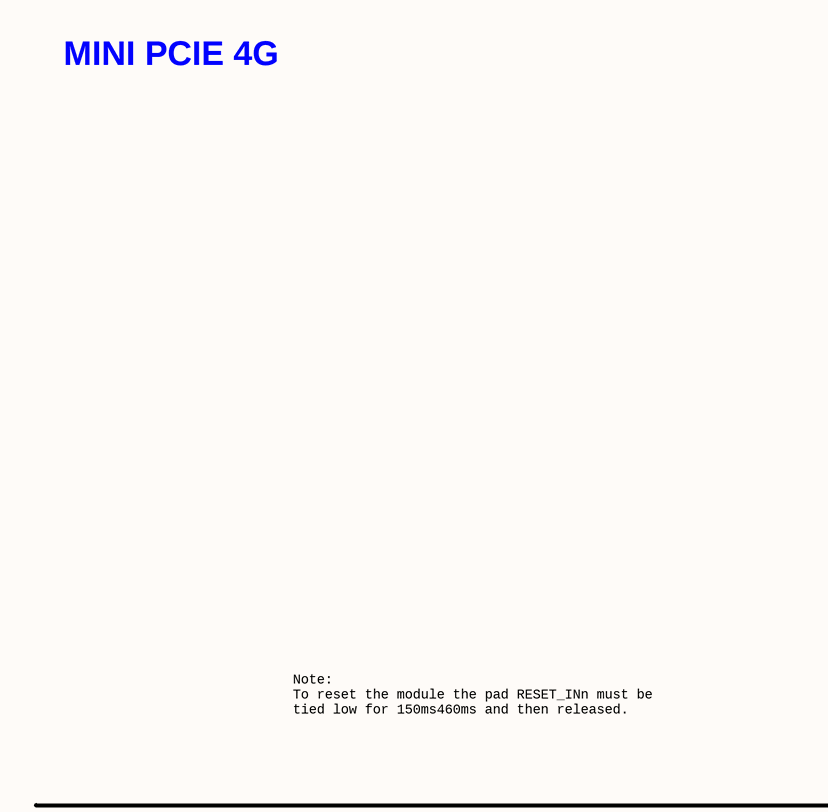
[diagram p29: P15_4G_5G_NVME.SchDoc, top left]
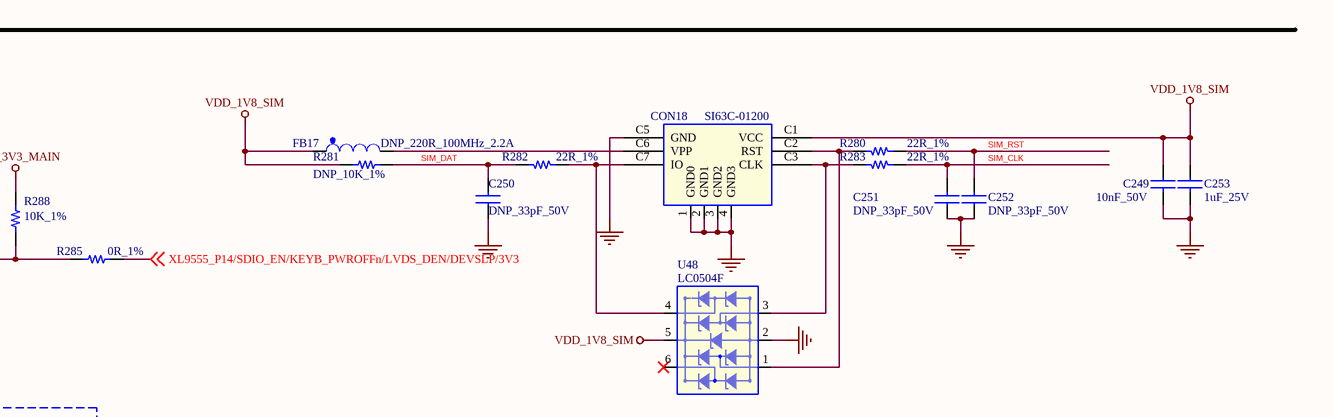
[diagram p30: P15_4G_5G_NVME.SchDoc, top right]
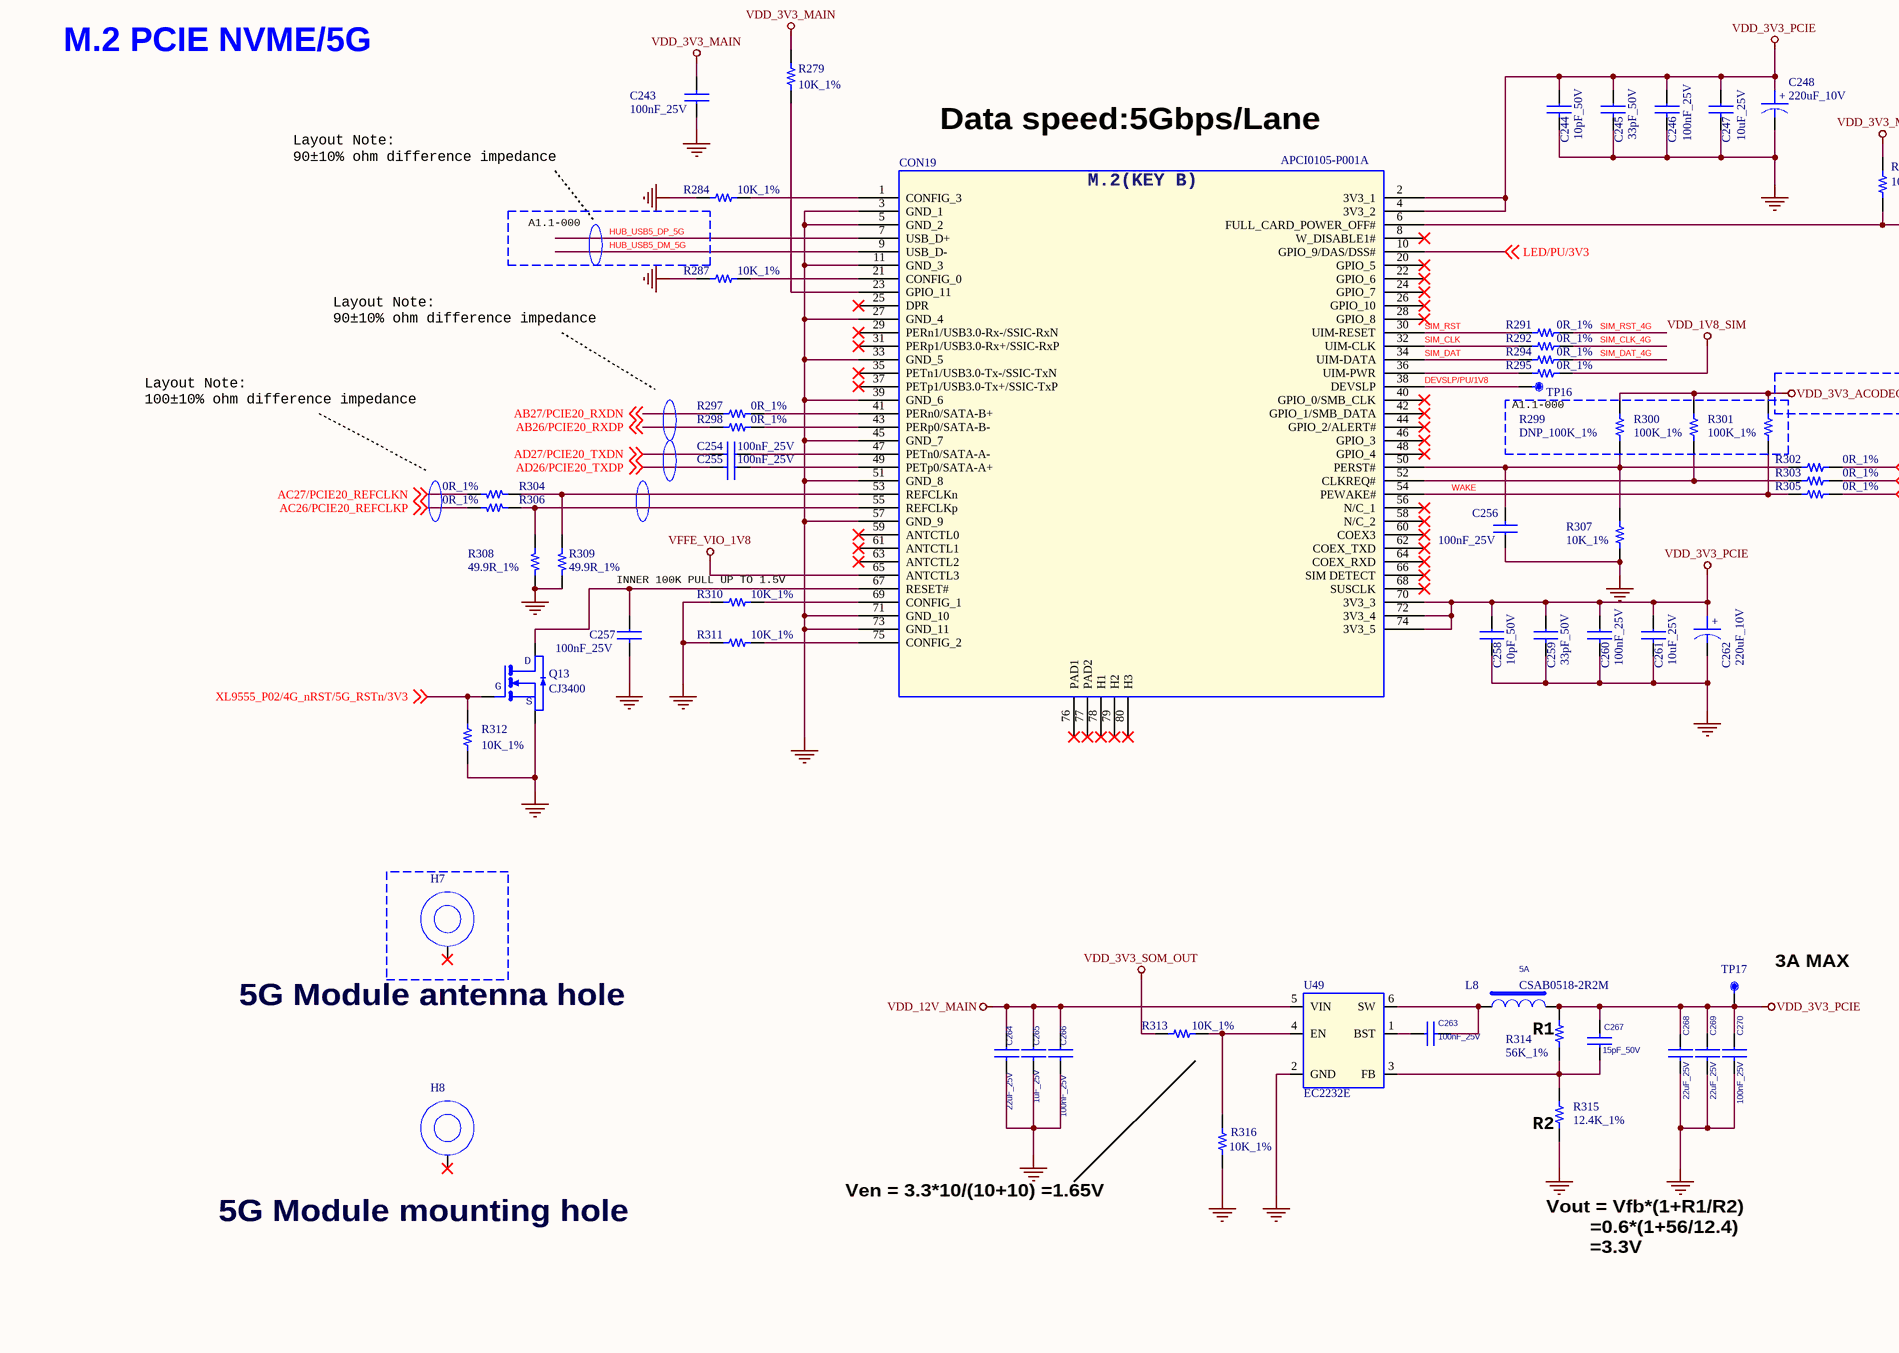
[diagram p31: P15_4G_5G_NVME.SchDoc, bottom left]
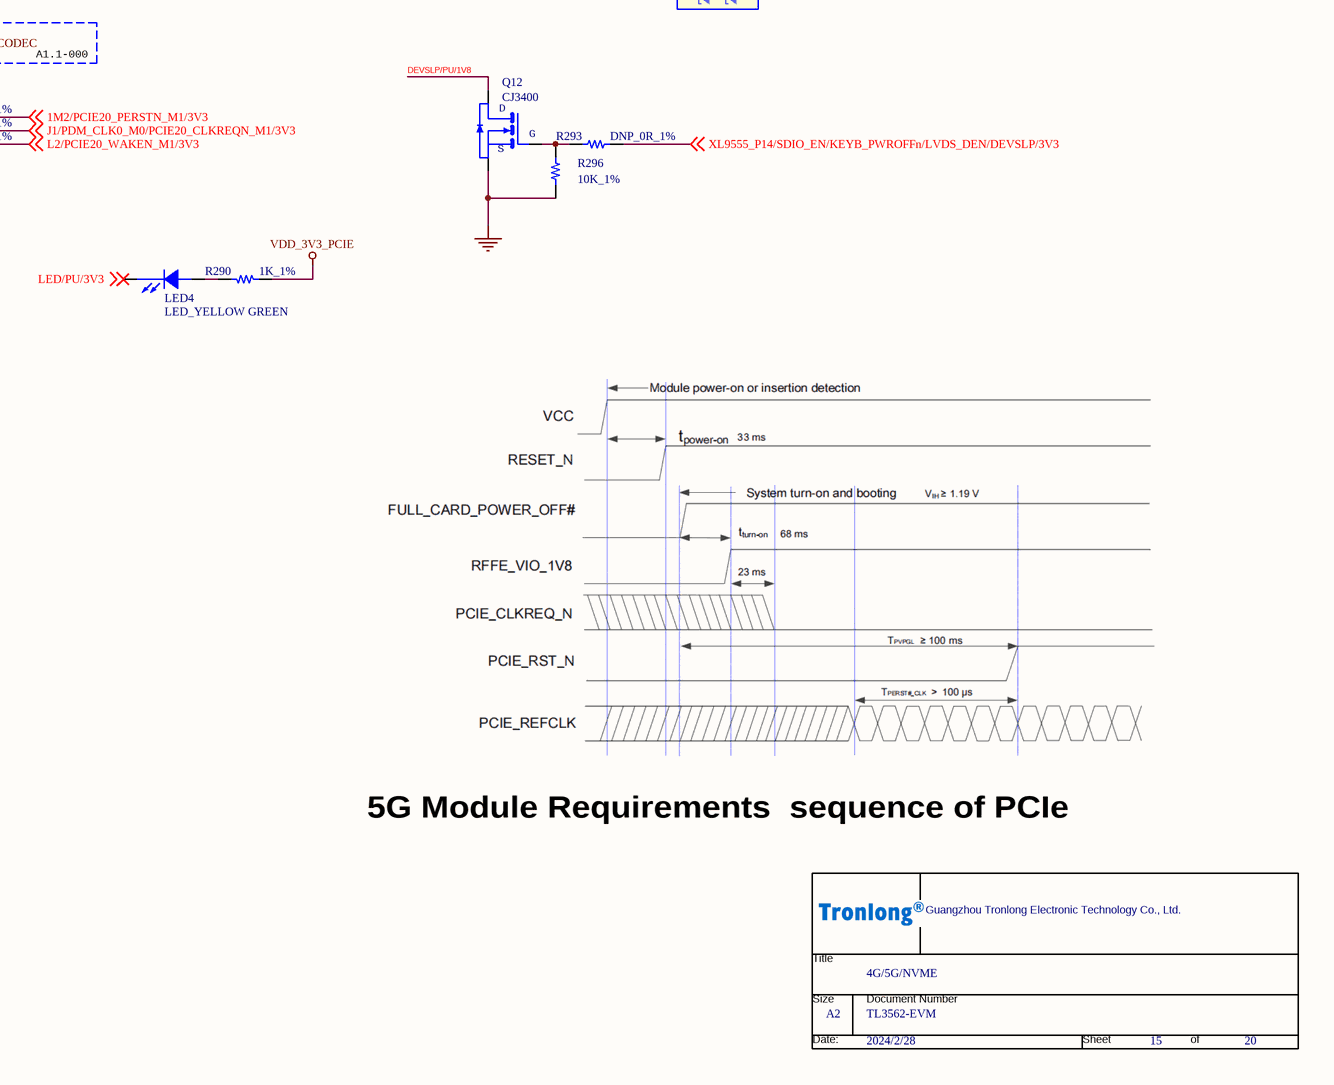
[diagram p32: P15_4G_5G_NVME.SchDoc, bottom right]

### Parts
(Parts that share a designator on the sheet are numbered #1, #2 ... from top to bottom, then left to right.)
*#15  Page Count: 20  Page Number: 15  Page Size: A2  OrgName: Guangzhou Tronlong Electronic Technology Co., Ltd.  Title: 4G/5G/NVME  Doc: TL3562-EVM  Page Modify Date: 2024/2/28  (hidden comment: Tronlong_TITTLE_20211115)  (graphical)
C243  100nF_25V  [C0402]
C244  10pF_50V  [C0603]
C245  33pF_50V  [C0603]
C246  100nF_25V  [C0402]
C247  10uF_25V  [C0603]
C248  220uF_10V  [CAP_CASE_D]
C249  10nF_50V  [C0402]
C250  DNP_33pF_50V  [C0603]
C251  DNP_33pF_50V  [C0603]
C252  DNP_33pF_50V  [C0603]
C253  1uF_25V  [C0603]
C254  100nF_25V  [C0402]
C255  100nF_25V  [C0402]
C256  100nF_25V  [C0402]
C257  100nF_25V  [C0402]
C258  10pF_50V  [C0603]
C259  33pF_50V  [C0603]
C260  100nF_25V  [C0402]
C261  10uF_25V  [C0603]
C262  220uF_10V  [CAP_CASE_D]
C263  100nF_25V  [C0402]
C264  22uF_25V  [C0805]
C265  1uF_25V  [C0603]
C266  100nF_25V  [C0402]
C267  15pF_50V  [C0402]
C268  22uF_25V  [C0805]
C269  22uF_25V  [C0805]
C270  100nF_25V  [C0402]
CON18  SI63C-01200  [micro-sim]
CON19  APCI0105-P001A  [conn-smd_apci0103-p001a]
FB17  DNP_220R_100MHz_2.2A  [L0603]
H7  HOLE  [NHOLE_C4_BT]  (value not drawn)
H8  HOLE  [5G_HOLE_3D5]  (value not drawn)
L8  CSAB0518-2R2M  Current: 5A  [SMD_CSAB0518]
LED4  LED_YELLOW GREEN  [D0603]
Q12  CJ3400  [SOT23-3_DBZ3]
Q13  CJ3400  [SOT23-3_DBZ3]
R279  10K_1%  [R0402]
R280  22R_1%  [R0402]
R281  DNP_10K_1%  [R0402]
R282  22R_1%  [R0402]
R283  22R_1%  [R0402]
R284  10K_1%  [R0402]
R285  0R_1%  [R0402]
R287  10K_1%  [R0402]
R288  10K_1%  [R0402]
R290  1K_1%  [R0402]
R291  0R_1%  [R0402]
R292  0R_1%  [R0402]
R293  DNP_0R_1%  [R0402]
R294  0R_1%  [R0402]
R295  0R_1%  [R0603]
R296  10K_1%  [R0402]
R297  0R_1%  [R0402]
R298  0R_1%  [R0402]
R299  DNP_100K_1%  [R0402]
R300  100K_1%  [R0402]
R301  100K_1%  [R0402]
R302  0R_1%  [R0402]
R303  0R_1%  [R0402]
R304  0R_1%  [R0402]
R305  0R_1%  [R0402]
R306  0R_1%  [R0402]
R307  10K_1%  [R0402]
R308  49.9R_1%  [R0603]
R309  49.9R_1%  [R0603]
R310  10K_1%  [R0402]
R311  10K_1%  [R0402]
R312  10K_1%  [R0402]
R313  10K_1%  [R0402]
R314  56K_1%  [R0402]
R315  12.4K_1%  [R0402]
R316  10K_1%  [R0402]
TP16  SMT TP  [TP-S40]  (value not drawn)
TP17  SMT TP  [TP-S40]  (value not drawn)
U48  LC0504F  [SOT363]
U49  EC2232E  [SOT-23-6L]

### Blocks framed on the sheet
A1.1-000: R299-R301

### Nets
GND: C243.1 C244.2 C245.2 C246.2 C247.2 C248.2 C249.2 C250.1 C251.1 C252.1 C253.2 C256.1 C257.2 C258.2 C259.2 C260.2 C261.2 C262.2 C264.2 C265.2 C266.2 C268.2 C269.2 C270.2 CON18.1(GND0) CON18.2(GND1) CON18.3(GND2) CON18.4(GND3) CON18.C5(GND) CON19.3(GND_1) CON19.5(GND_2) CON19.11(GND_3) CON19.27(GND_4) CON19.33(GND_5) CON19.39(GND_6) CON19.45(GND_7) CON19.51(GND_8) CON19.57(GND_9) CON19.71(GND_10) CON19.73(GND_11) Q12.2(E) Q13.2(E) R284.2 R287.2 R296.2 R307.2 R308.1 R309.1 R310.2 R311.2 R312.2 R315.1 R316.1 U48.2 U49.2(GND)
VDD_1V8_SIM: C249.1 C253.1 CON18.C1(VCC) FB17.1 R281.1 R295.1 U48.5
VDD_3V3_ACODEC: R299.1 R300.1 R301.1
VDD_3V3_MAIN: C243.2 R279.1 R288.1
VDD_3V3_PCIE: C244.1 C245.1 C246.1 C247.1 C248.1 C258.1 C259.1 C260.1 C261.1 C262.1 C267.2 C268.1 C269.1 C270.1 CON19.2(3V3_1) CON19.4(3V3_2) CON19.70(3V3_3) CON19.72(3V3_4) CON19.74(3V3_5) L8.2 R290.1 R314.2 TP17.1
VDD_3V3_SOM_OUT: R313.2
VDD_12V_MAIN: C264.1 C265.1 C266.1 U49.5(VIN)
VFFE_VIO_1V8: CON19.65(ANTCTL3)
1M2/PCIE20_PERSTN_M1/3V3: R302.1 ; off-sheet 1M2/PCIE20_PERSTN_M1/3V3
AB26/PCIE20_RXDP: R298.1 ; off-sheet AB26/PCIE20_RXDP
AB27/PCIE20_RXDN: R297.1 ; off-sheet AB27/PCIE20_RXDN
AC26/PCIE20_REFCLKP: R306.2 ; off-sheet AC26/PCIE20_REFCLKP
AC27/PCIE20_REFCLKN: R304.2 ; off-sheet AC27/PCIE20_REFCLKN
AD26/PCIE20_TXDP: C255.2 ; off-sheet AD26/PCIE20_TXDP
AD27/PCIE20_TXDN: C254.2 ; off-sheet AD27/PCIE20_TXDN
DEVSLP/PU/1V8: CON19.38(DEVSLP) Q12.3(C) TP16.1
HUB_USB5_DM_5G: CON19.9(USB_D-)
HUB_USB5_DP_5G: CON19.7(USB_D+)
J1/PDM_CLK0_M0/PCIE20_CLKREQN_M1/3V3: R303.1 ; off-sheet J1/PDM_CLK0_M0/PCIE20_CLKREQN_M1/3V3
L2/PCIE20_WAKEN_M1/3V3: R305.1 ; off-sheet L2/PCIE20_WAKEN_M1/3V3
LED/PU/3V3: CON19.10(GPIO_9/DAS/DSS#) LED4.2(ANODE) ; off-sheet LED/PU/3V3
SIM_CLK: C251.2 CON19.32(UIM-CLK) R283.2 R292.2
SIM_CLK_4G: R292.1
SIM_DAT: C250.2 CON19.34(UIM-DATA) R281.2 R282.1 R294.2
SIM_DAT_4G: R294.1
SIM_RST: C252.2 CON19.30(UIM-RESET) R280.2 R291.2
SIM_RST_4G: R291.1
WAKE: CON19.54(PEWAKE#) R301.2 R305.2
XL9555_P02/4G_nRST/5G_RSTn/3V3: Q13.1(B) R312.1 ; off-sheet XL9555_P02/4G_nRST/5G_RSTn/3V3
XL9555_P14/SDIO_EN/KEYB_PWROFFn/LVDS_DEN/DEVSLP/3V3: R285.1 R293.2 ; off-sheet XL9555_P14/SDIO_EN/KEYB_PWROFFn/LVDS_DEN/DEVSLP/3V3
NetC254_1: C254.1 CON19.47(PETn0/SATA-A-)
NetC255_1: C255.1 CON19.49(PETp0/SATA-A+)
NetC256_2: C256.2 CON19.50(PERST#) R299.2 R302.2 R307.1
NetC257_1: C257.1 CON19.67(RESET#) Q13.3(C)
NetC263_1: C263.1 U49.1(BST)
NetC263_2: C263.2 L8.1 U49.6(SW)
NetC267_1: C267.1 R314.1 R315.2 U49.3(FB)
NetCON18_C2: CON18.C2(RST) R280.1 U48.1
NetCON18_C3: CON18.C3(CLK) R283.1 U48.3
NetCON18_C6: CON18.C6(VPP) FB17.2
NetCON18_C7: CON18.C7(IO) R282.2 U48.4
NetCON19_1: CON19.1(CONFIG_3) R284.1
NetCON19_6: CON19.6(FULL_CARD_POWER_OFF#) R285.2 R288.2
NetCON19_21: CON19.21(CONFIG_0) R287.1
NetCON19_23: CON19.23(GPIO_11) R279.2
NetCON19_36: CON19.36(UIM-PWR) R295.2
NetCON19_41: CON19.41(PERn0/SATA-B+) R297.2
NetCON19_43: CON19.43(PERp0/SATA-B-) R298.2
NetCON19_52: CON19.52(CLKREQ#) R300.2 R303.2
NetCON19_53: CON19.53(REFCLKn) R304.1 R309.2
NetCON19_55: CON19.55(REFCLKp) R306.1 R308.2
NetCON19_69: CON19.69(CONFIG_1) R310.1
NetCON19_75: CON19.75(CONFIG_2) R311.1
NetLED4_1: LED4.1(CATHODE) R290.2
NetQ12_1: Q12.1(B) R293.1 R296.1
NetR313_1: R313.1 R316.2 U49.4(EN)

Not connected (* = marked no-connect by the designer): CON19 8(W_DISABLE1#)* 20(GPIO_5)* 22(GPIO_6)* 24(GPIO_7)* 25(DPR)* 26(GPIO_10)* 28(GPIO_8)* 29(PERn1/USB3.0-Rx-/SSIC-RxN)* 31(PERp1/USB3.0-Rx+/SSIC-RxP)* 35(PETn1/USB3.0-Tx-/SSIC-TxN)* 37(PETp1/USB3.0-Tx+/SSIC-TxP)* 40(GPIO_0/SMB_CLK)* 42(GPIO_1/SMB_DATA)* 44(GPIO_2/ALERT#)* 46(GPIO_3)* 48(GPIO_4)* 56(N/C_1)* 58(N/C_2)* 59(ANTCTL0)* 60(COEX3)* 61(ANTCTL1)* 62(COEX_TXD)* 63(ANTCTL2)* 64(COEX_RXD)* 66(SIM_DETECT)* 68(SUSCLK)* 76(PAD1)* 77(PAD2)* 78(H1)* 79(H2)* 80(H3)*; H7 1*; H8 1*; U48 6*

### Notes on the sheet
- MINI PCIE 4G
- Note:
  To reset the module the pad RESET_INn must be
  tied low for 150ms460ms and then released.
- M.2 PCIE NVME/5G
- Layout Note:
  90±10% ohm difference impedance
- Data speed:5Gbps/Lane
- A1.1-000
- Layout Note:
  100±10% ohm difference impedance
- (near R310) INNER 100K PULL UP TO 1.5V
- (near H7) 5G Module antenna hole
- R1
- (near TP17) 3A MAX
- (near R315) R2
- (near *#15) 5G Module Requirements  sequence of PCIe
- (near H8) 5G Module mounting hole
- Ven = 3.3*10/(10+10) =1.65V
- Vout = Vfb*(1+R1/R2)
  =0.6*(1+56/12.4)
  =3.3V
- (in symbol CAP POL_Dup1) +
- (in symbol CON_M_1) M.2(KEY B)
- (in symbol MMBT3904/SOT_1) D; G; S
- (in symbol MOSFET N SOT) D; G; S
- (in symbol Tronlong_TITTLE_20211115) Title; Size; Document Number; Date:; Sheet; of

### Library data of the parts
*#15 = Tronlong_TITTLE_20211115: RevCode: A?; Page Create Date: March  8, 1995
C243 C256 = CAP NP_Dup3: 贴片陶瓷电容,100nF,10%,25V,X5R; Manufacturer Character: 中国大陆; room: USB HUB; Operation Temperature（℃）: -55~85℃; As-Welded: /; PCB Footprint: C0402
C244 = CAP NP_Dup3: 贴片陶瓷电容,10pF,5%,50V,COG; Manufacturer Character: 中国大陆; Operation Temperature（℃）: -55~125℃; As-Welded: /; PCB Footprint: C0603; Temperature: -55~125℃
C245 = CAP NP_Dup3: 贴片陶瓷电容,33pF,5%,50V,COG; Manufacturer Character: 中国大陆; Operation Temperature（℃）: -55~125℃; As-Welded: /; PCB Footprint: C0603; Temperature: -55~125℃
C246 C263 C266 C270 = CAP NP_Dup3: 贴片陶瓷电容,100nF,10%,25V,X5R; Manufacturer Character: 中国大陆; Operation Temperature（℃）: -55~85℃; As-Welded: /; PCB Footprint: C0402; Temperature: -55~125℃
C247 = CAP NP_Dup3: 贴片陶瓷电容,10uF,10%,10V,X5R; Manufacturer Character: 中国大陆; As-Welded: /; Operation Temperature（℃）: -55~85℃; room: 6; PCB Footprint: C0603; Temperature: -55~125℃
C248 = CAP POL_Dup1: D型钽电容,220uF,10%,10V; Manufacturer PartNumber: CA45-D010K227T; Manufacturer: 湖南湘怡中元科技有限公司（XIANGYEE）; Manufacturer Character: 中国大陆; As-Welded: /; Operation Temperature（℃）: -55~125℃; PCB Footprint: CAP_CASE_D; Temperature: -55~125℃
C249 = CAP NP_Dup3: 贴片陶瓷电容,10nF,10%,50V,X7R; Manufacturer Character: 中国大陆; Operation Temperature（℃）: -55~125℃; As-Welded: /; PCB Footprint: C0402; Temperature: –55~125℃
C250 = CAP NP_Dup3: 贴片陶瓷电容,33pF,5%,50V,COG; Manufacturer Character: 中国大陆; Operation Temperature（℃）: -55~125℃; As-Welded: DNP; PCB Footprint: C0603; Temperature: -55~155℃
C251 C252 = CAP NP_Dup3: 贴片陶瓷电容,33pF,5%,50V,COG; Manufacturer Character: 中国大陆; As-Welded: DNP; Operation Temperature（℃）: -55~125℃; PCB Footprint: C0603; Temperature: -55~155℃
C253 C265 = CAP NP_Dup3: 贴片陶瓷电容,1uF,10%,25V,X5R; Manufacturer Character: 中国大陆; Operation Temperature（℃）: -55~85℃; As-Welded: /; PCB Footprint: C0603
C254 C255 C257 C260 = CAP NP_Dup3: 贴片陶瓷电容,100nF,10%,25V,X5R; Manufacturer Character: 中国大陆; As-Welded: /; Operation Temperature（℃）: -55~85℃; PCB Footprint: C0402; Temperature: -55~125℃
C258 = CAP NP_Dup3: 贴片陶瓷电容,10pF,5%,50V,COG; Manufacturer Character: 中国大陆; As-Welded: /; Operation Temperature（℃）: -55~125℃; PCB Footprint: C0603; Temperature: -55~125℃
C259 = CAP NP_Dup3: 贴片陶瓷电容,33pF,5%,50V,COG; Manufacturer Character: 中国大陆; As-Welded: /; Operation Temperature（℃）: -55~125℃; PCB Footprint: C0603; Temperature: -55~125℃
C261 = CAP NP_Dup3: 贴片陶瓷电容,10uF,10%,10V,X5R; Manufacturer Character: 中国大陆; Operation Temperature（℃）: -55~85℃; room: 6; As-Welded: /; PCB Footprint: C0603; Temperature: -55~125℃
C262 = CAP POL_Dup1: D型钽电容,220uF,10%,10V; Manufacturer Character: 中国大陆; Manufacturer PartNumber: CA45-D010K227T; Manufacturer: 湖南湘怡中元科技有限公司（XIANGYEE）; Operation Temperature（℃）: -55~125℃; As-Welded: /; PCB Footprint: CAP_CASE_D; Temperature: -55~125℃
C264 C268 = CAP NP_Dup3: 贴片陶瓷电容,22uF,20%,25V,X5R; Manufacturer Character: 中国大陆; As-Welded: /; Operation Temperature（℃）: -55~85℃; PCB Footprint: C0805; Temperature: -55~125℃
C267 = CAP NP_Dup3: 贴片陶瓷电容,15pF,5%,50V,COG; Manufacturer Character: 中国大陆; As-Welded: /; Operation Temperature（℃）: -55~125℃; Temperature: -55~125℃; PCB Footprint: C0402
C269 = CAP NP_Dup3: 贴片陶瓷电容,22uF,20%,25V,X5R; Manufacturer Character: 中国大陆; Operation Temperature（℃）: -55~85℃; As-Welded: /; PCB Footprint: C0805; Temperature: -55~125℃
CON18 = SIM_CARD_2: Micro SIM卡座,6P,自弹; Manufacturer: 深圳市爱特姆科技有限公司( ATOM); Manufacturer Character: 中国大陆; As-Welded: /; Manufacturer PartNumber: SI63C-01200; Temperature: -40~85℃; PCB Footprint: micro-sim
CON19 = CON_M_1: NGFF（M.2）金手指连接器，KEY B,高4.2mm; Manufacturer: 深圳市连欣科技有限公司; Manufacturer Character: 中国大陆; As-Welded: /; PCB Footprint: conn-smd_apci0103-p001a; Manufacturer PartNumber: APCI0105-P001A
FB17 = FB_0: 磁珠,50mΩ,2.2A,220R@100MHz; Manufacturer Character: 中国大陆; Manufacturer: 深圳顺络电子股份有限公司（Sunlord）; Manufacturer PartNumber: UPZ1608U221-2R2TF; room: 6; As-Welded: DNP; Operation Temperature（℃）: -55~125℃; Temperature: -55~125℃; PCB Footprint: L0603
H7 H8 = HOLE: Manufacturer Character: 中国大陆; As-Welded: /
  H7: PCB Footprint: NHOLE_C4_BT
  H8: PCB Footprint: 5G_HOLE_3D5
L8 = INDUCTOR: 贴片功率电感,2.2uH,0.035Ω,Isat=6.5A,Irms=5A; Manufacturer: 深圳市科达嘉电子有限公司（CODACA）; Manufacturer Character: 中国大陆; Parameter: L2520，奇力新一体成型电感，最大额定电流3A，内阻65毫欧，20%; As-Welded: /; Operation Temperature（℃）: -40~125℃; Manufacturer PartNumber: CSAB0518-2R2M; Temperature: -40~125℃; PCB Footprint: SMD_CSAB0518
LED4 = LED_0: 贴片式发光二极管,黄绿色,普亮; Manufacturer Character: 中国大陆; Manufacturer: 东莞市亿晶源光电科技有限公司（ekinglux）; Manufacturer PartNumber: E6C0603YGAC1UDA; As-Welded: /; Operation Temperature（℃）: -40~90℃; PCB Footprint: D0603; Temperature: -55~85℃
Q12 = MMBT3904/SOT_1: MOSFET,N沟道,VDSS=30V,VGSS=±12V,ID=5.8A,PD=0.35W,VGS(th)=1.4V; Manufacturer: 江苏长晶科技股份有限公司（JSCJ）; Manufacturer Character: 中国大陆; As-Welded: /; Operation Temperature（℃）: -55~150℃; ROOM: DSP_LED; PCB Footprint: SOT23-3_DBZ3; Manufacturer PartNumber: CJ3400
Q13 = MOSFET N SOT: MOSFET,N沟道,VDSS=30V,VGSS=±12V,ID=5.8A,PD=0.35W,VGS(th)=1.4V; Manufacturer: 江苏长晶科技股份有限公司（JSCJ）; Manufacturer Character: 中国大陆; Operation Temperature（℃）: -55~150℃; ROOM: DSP_LED; As-Welded: /; PCB Footprint: SOT23-3_DBZ3; Manufacturer PartNumber: CJ3400; Temperature: -55~150℃
R279 R310-R312 = Resistor_Dup3: 贴片电阻,10K,±1%,1/16W; Manufacturer Character: 中国大陆; CLASS: DISCRETE; room: USB HUB; Operation Temperature（℃）: -55~155℃; As-Welded: /; PCB Footprint: R0402
R280 R282 R283 = Resistor_Dup3: 贴片电阻,22R,±1%,1/16W; Manufacturer Character: 中国大陆; CLASS: DISCRETE; As-Welded: /; Operation Temperature（℃）: -55~155℃; PCB Footprint: R0402; Temperature: -55~155℃
R281 = Resistor_Dup3: 贴片电阻,10K,±1%,1/16W; Manufacturer Character: 中国大陆; CLASS: DISCRETE; Operation Temperature（℃）: -55~155℃; As-Welded: DNP; PCB Footprint: R0402; Temperature: -55~155℃
R284 R296 R307 = Resistor_Dup3: 贴片电阻,10K,±1%,1/16W; Manufacturer Character: 中国大陆; CLASS: DISCRETE; As-Welded: /; Operation Temperature（℃）: -55~155℃; room: USB HUB; PCB Footprint: R0402
R285 R291 R292 R294 = Resistor_Dup3: 贴片电阻,0R,±1%,1/16W; Manufacturer Character: 中国大陆; CLASS: DISCRETE; Operation Temperature（℃）: -55~155℃; As-Welded: /; PCB Footprint: R0402
R287 = Resistor_Dup3: 贴片电阻,10K,±1%,1/16W; Manufacturer Character: 中国大陆; CLASS: DISCRETE; Operation Temperature（℃）: -55~155℃; room: USB HUB; As-Welded: /; PCB Footprint: R0402
R288 = Resistor_Dup3: 贴片电阻,10K,±1%,1/16W; Manufacturer Character: 中国大陆; CLASS: DISCRETE; As-Welded: /; room: USB HUB; Operation Temperature（℃）: -55~155℃; PCB Footprint: R0402
R290 = R 1%: 贴片电阻,1K,±1%,1/16W; Manufacturer Character: 中国大陆; Characteristic: 0402 1/16W +/-1%; CLASS: DISCRETE; As-Welded: /; Operation Temperature（℃）: -55~155℃; PCB Footprint: R0402; Temperature: -55~155℃
R293 = Resistor_Dup3: 贴片电阻,0R,±1%,1/16W; Manufacturer Character: 中国大陆; CLASS: DISCRETE; As-Welded: DNP; Operation Temperature（℃）: -55~155℃; PCB Footprint: R0402
R295 = Resistor_Dup3: 贴片电阻,0R,±1%,1/10W; Manufacturer Character: 中国大陆; CLASS: DISCRETE; As-Welded: /; Operation Temperature（℃）: -55~155℃; PCB Footprint: R0603
R297 R302 R303 R305 = Resistor_Dup3: 贴片电阻,0R,±1%,1/16W; Manufacturer Character: 中国大陆; CLASS: DISCRETE; As-Welded: /; Operation Temperature（℃）: -55~155℃; room: USB HUB; PCB Footprint: R0402
R298 = Resistor_Dup3: 贴片电阻,0R,±1%,1/16W; Manufacturer Character: 中国大陆; CLASS: DISCRETE; As-Welded: /; room: USB HUB; Operation Temperature（℃）: -55~155℃; PCB Footprint: R0402
R299 = Resistor_Dup3: 贴片电阻,100K,±1%,1/16W; Manufacturer Character: 中国大陆; CLASS: DISCRETE; Operation Temperature（℃）: -55~155℃; room: USB HUB; As-Welded: DNP; PCB Footprint: R0402
R300 = Resistor_Dup3: 贴片电阻,100K,±1%,1/16W; Manufacturer Character: 中国大陆; CLASS: DISCRETE; As-Welded: /; room: USB HUB; Operation Temperature（℃）: -55~155℃; PCB Footprint: R0402
R301 = Resistor_Dup3: 贴片电阻,100K,±1%,1/16W; Manufacturer Character: 中国大陆; CLASS: DISCRETE; Operation Temperature（℃）: -55~155℃; room: USB HUB; As-Welded: /; PCB Footprint: R0402
R304 R306 = Resistor_Dup3: 贴片电阻,0R,±1%,1/16W; Manufacturer Character: 中国大陆; CLASS: DISCRETE; As-Welded: /; Operation Temperature（℃）: -55~155℃; PCB Footprint: R0402
R308 = Resistor_Dup3: 贴片电阻,49.9R,±1%,1/10W; Manufacturer Character: 中国大陆; CLASS: DISCRETE; As-Welded: /; Operation Temperature（℃）: -55~125℃; PCB Footprint: R0603
R309 = Resistor_Dup3: 贴片电阻,49.9R,±1%,1/10W; Manufacturer Character: 中国大陆; CLASS: DISCRETE; Operation Temperature（℃）: -55~125℃; As-Welded: /; PCB Footprint: R0603
R313 R316 = Resistor_Dup3: 贴片电阻,10K,±1%,1/16W; Manufacturer Character: 中国大陆; CLASS: DISCRETE; As-Welded: /; Operation Temperature（℃）: -55~155℃; PCB Footprint: R0402; Temperature: –55~155℃
R314 = Resistor_Dup3: 贴片电阻,56K,±1%,1/16W; Manufacturer Character: 中国大陆; CLASS: DISCRETE; Operation Temperature（℃）: -55~155℃; As-Welded: /; PCB Footprint: R0402; Temperature: -55~155℃
R315 = Resistor_Dup3: 贴片电阻,12.4K,±1%,1/16W; Manufacturer Character: 中国大陆; CLASS: DISCRETE; As-Welded: /; Operation Temperature（℃）: -55~155℃; PCB Footprint: R0402; Temperature: -55~155℃
TP16 = TP-S40: Manufacturer Character: 中国大陆; Characteristic: Test point,diameter=1.0mm; As-Welded: /; room: USB HUB; PCB Footprint: TP30
TP17 = TP-S40: Manufacturer Character: 中国大陆; Characteristic: Test point,diameter=1.0mm; PCB Footprint: TP30; As-Welded: /
U48 = PRTR5V0U4Y_0: ESD二极管,VRWM=5V,VBR=6V,四组,单向,8KV,15KV; Manufacturer: 上海雷卯电子科技有限公司（Leiditech）; Manufacturer Character: 中国大陆; As-Welded: /; room: SD; Operation Temperature（℃）: -55~125℃; Temperature: -40~85℃; Manufacturer PartNumber: LC0504F; Manufacturer Part Number: PRTR5V0U4Y; PCB Footprint: SOT363
U49 = WD1304E30: DC/DC,Buck,Vin:4.5V~17V,Vout:0.6V~6V,3A,1路; Manufacturer: 上海芯强微电子股份有限公司（Ecranic）; Manufacturer Character: 中国大陆; As-Welded: /; Operation Temperature（℃）: -40~85℃; Temperature: -40~85℃; Manufacturer PartNumber: EC2232E; PCB Footprint: SOT-23-6L

## Sheet P16_AUDIO.SchDoc
size 297 x 209 mm
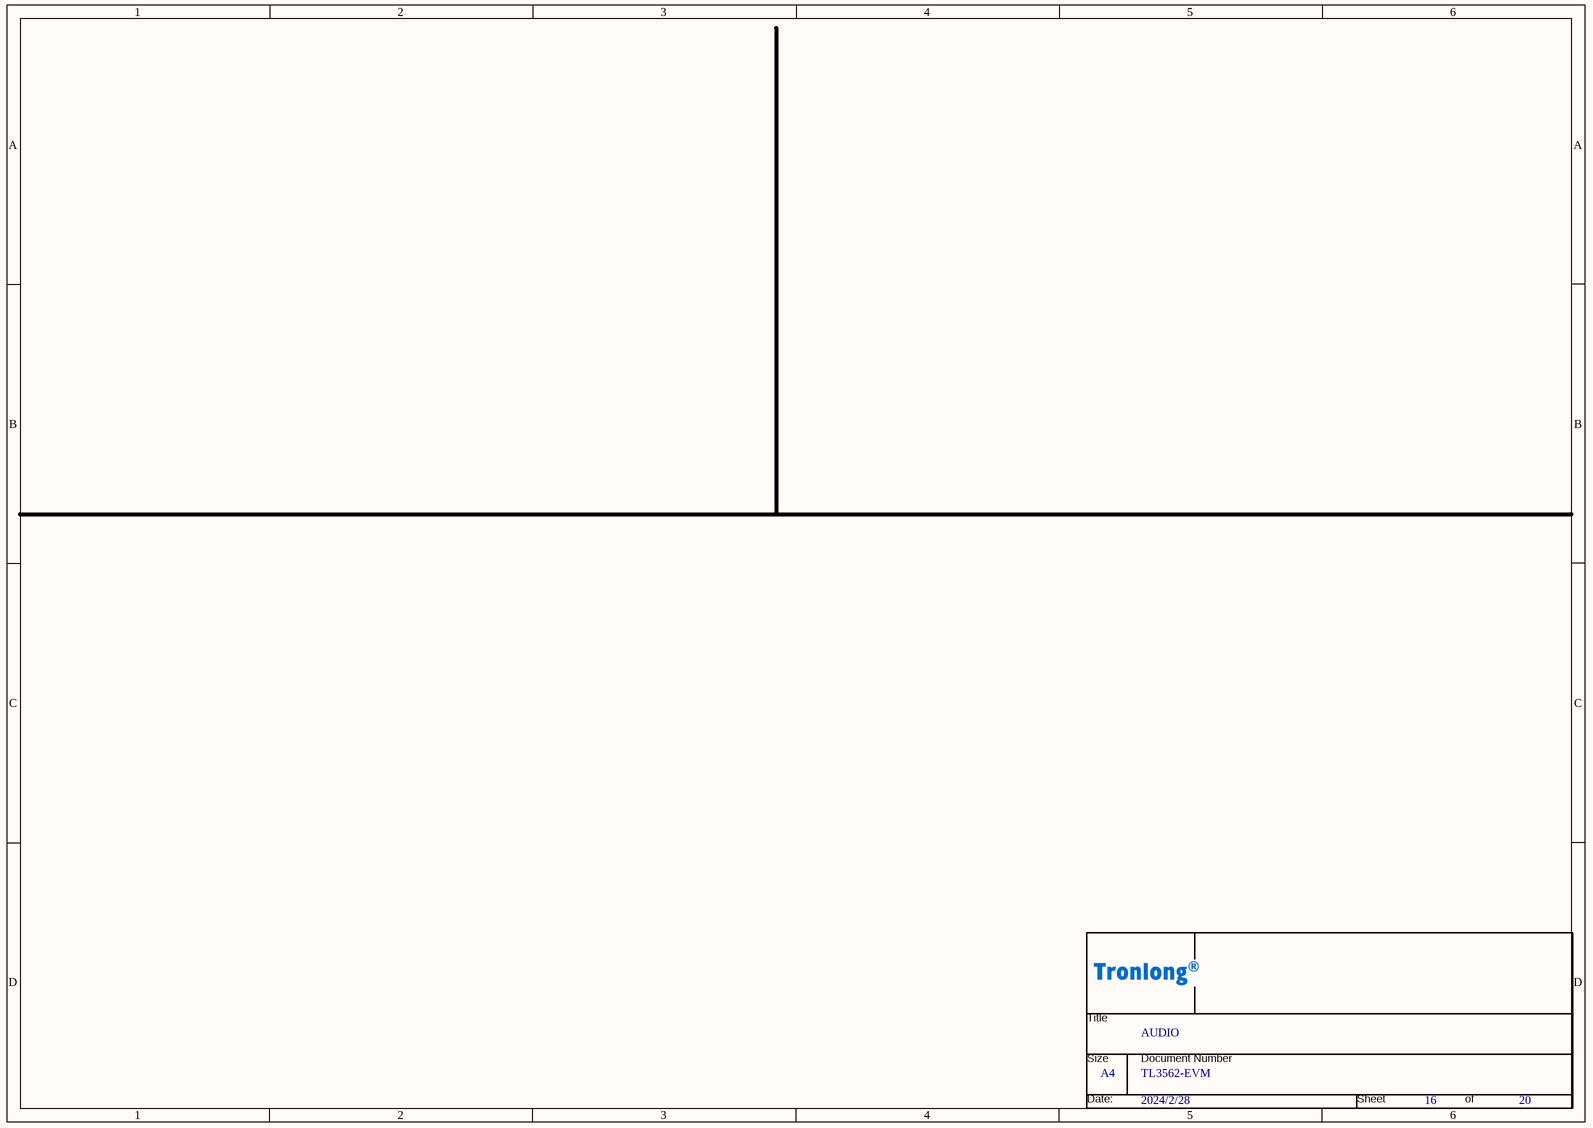
[diagram p33: P16_AUDIO.SchDoc]

### Parts
(Parts that share a designator on the sheet are numbered #1, #2 ... from top to bottom, then left to right.)
*#16  Page Count: 20  Page Number: 16  Page Size: A4  Title: AUDIO  Doc: TL3562-EVM  Page Modify Date: 2024/2/28  (hidden comment: Tronlong_TITTLE_20211115)  (graphical)

### Notes on the sheet
- (in symbol Tronlong_TITTLE_20211115) Title; Size; Document Number; Date:; Sheet; of

### Library data of the parts
*#16 = Tronlong_TITTLE_20211115: RevCode: A?; Page Create Date: March  8, 1995

## Sheet P17_LVDS LCD.SchDoc
size 420 x 297 mm
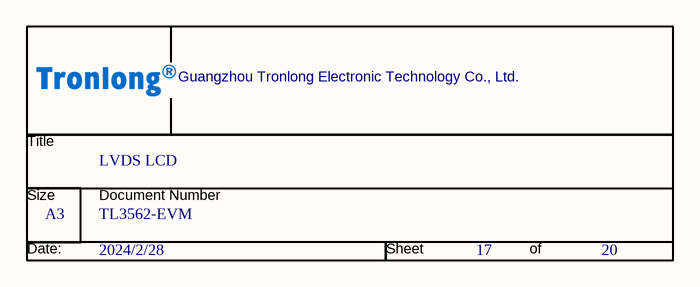
[diagram p34: P17_LVDS LCD.SchDoc]

### Parts
(Parts that share a designator on the sheet are numbered #1, #2 ... from top to bottom, then left to right.)
*#17  Page Count: 20  Page Number: 17  Page Size: A3  OrgName: Guangzhou Tronlong Electronic Technology Co., Ltd.  Title: LVDS LCD  Doc: TL3562-EVM  Page Modify Date: 2024/2/28  (hidden comment: Tronlong_TITTLE_20211115)  (graphical)

### Notes on the sheet
- (in symbol Tronlong_TITTLE_20211115) Title; Size; Document Number; Date:; Sheet; of

### Library data of the parts
*#17 = Tronlong_TITTLE_20211115: RevCode: A?; Page Create Date: March  8, 1995

## Sheet P18_CAMERA_MIPI LCD.SchDoc
size 594 x 420 mm
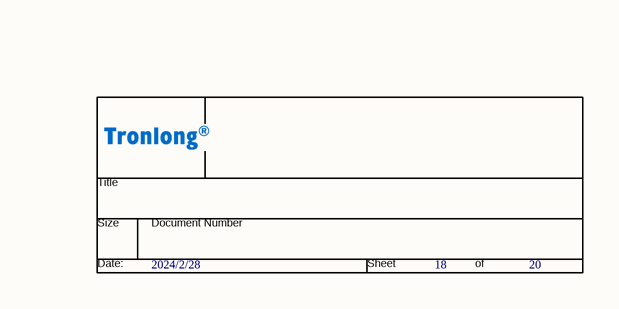
[diagram p35: P18_CAMERA_MIPI LCD.SchDoc, right]

### Parts
(Parts that share a designator on the sheet are numbered #1, #2 ... from top to bottom, then left to right.)
*#18  Page Count: 20  Page Number: 18  Page Modify Date: 2024/2/28  (hidden comment: Tronlong_TITTLE_20211115)  (graphical)

### Notes on the sheet
- (in symbol Tronlong_TITTLE_20211115) Title; Size; Document Number; Date:; Sheet; of

### Library data of the parts
*#18 = Tronlong_TITTLE_20211115: RevCode: A?; Page Create Date: March  8, 1995